# EAGLE board RastoMower (EAGLE 9.6.2), part 1 of 2
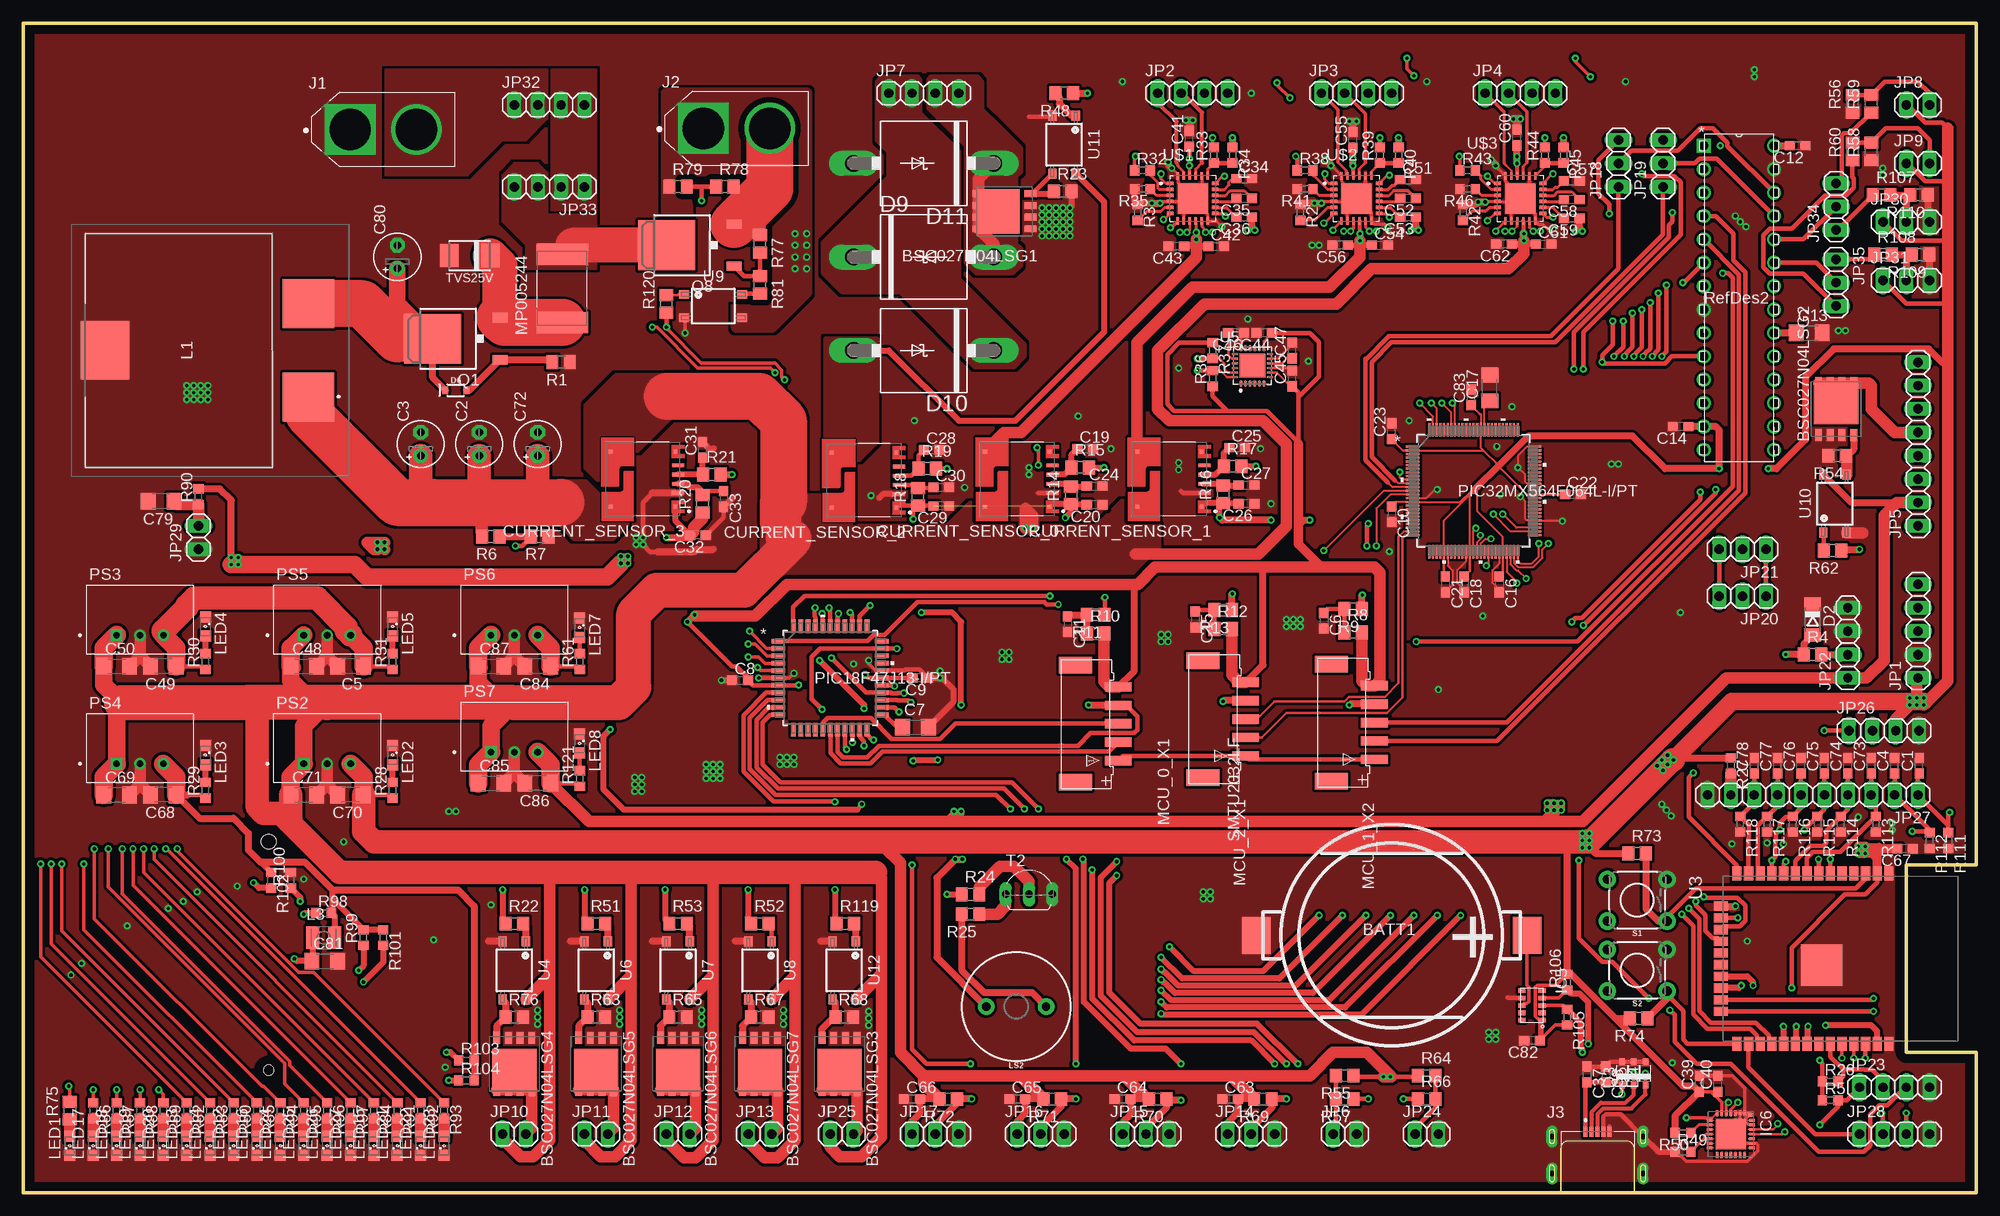
[diagram p10: board, top side]
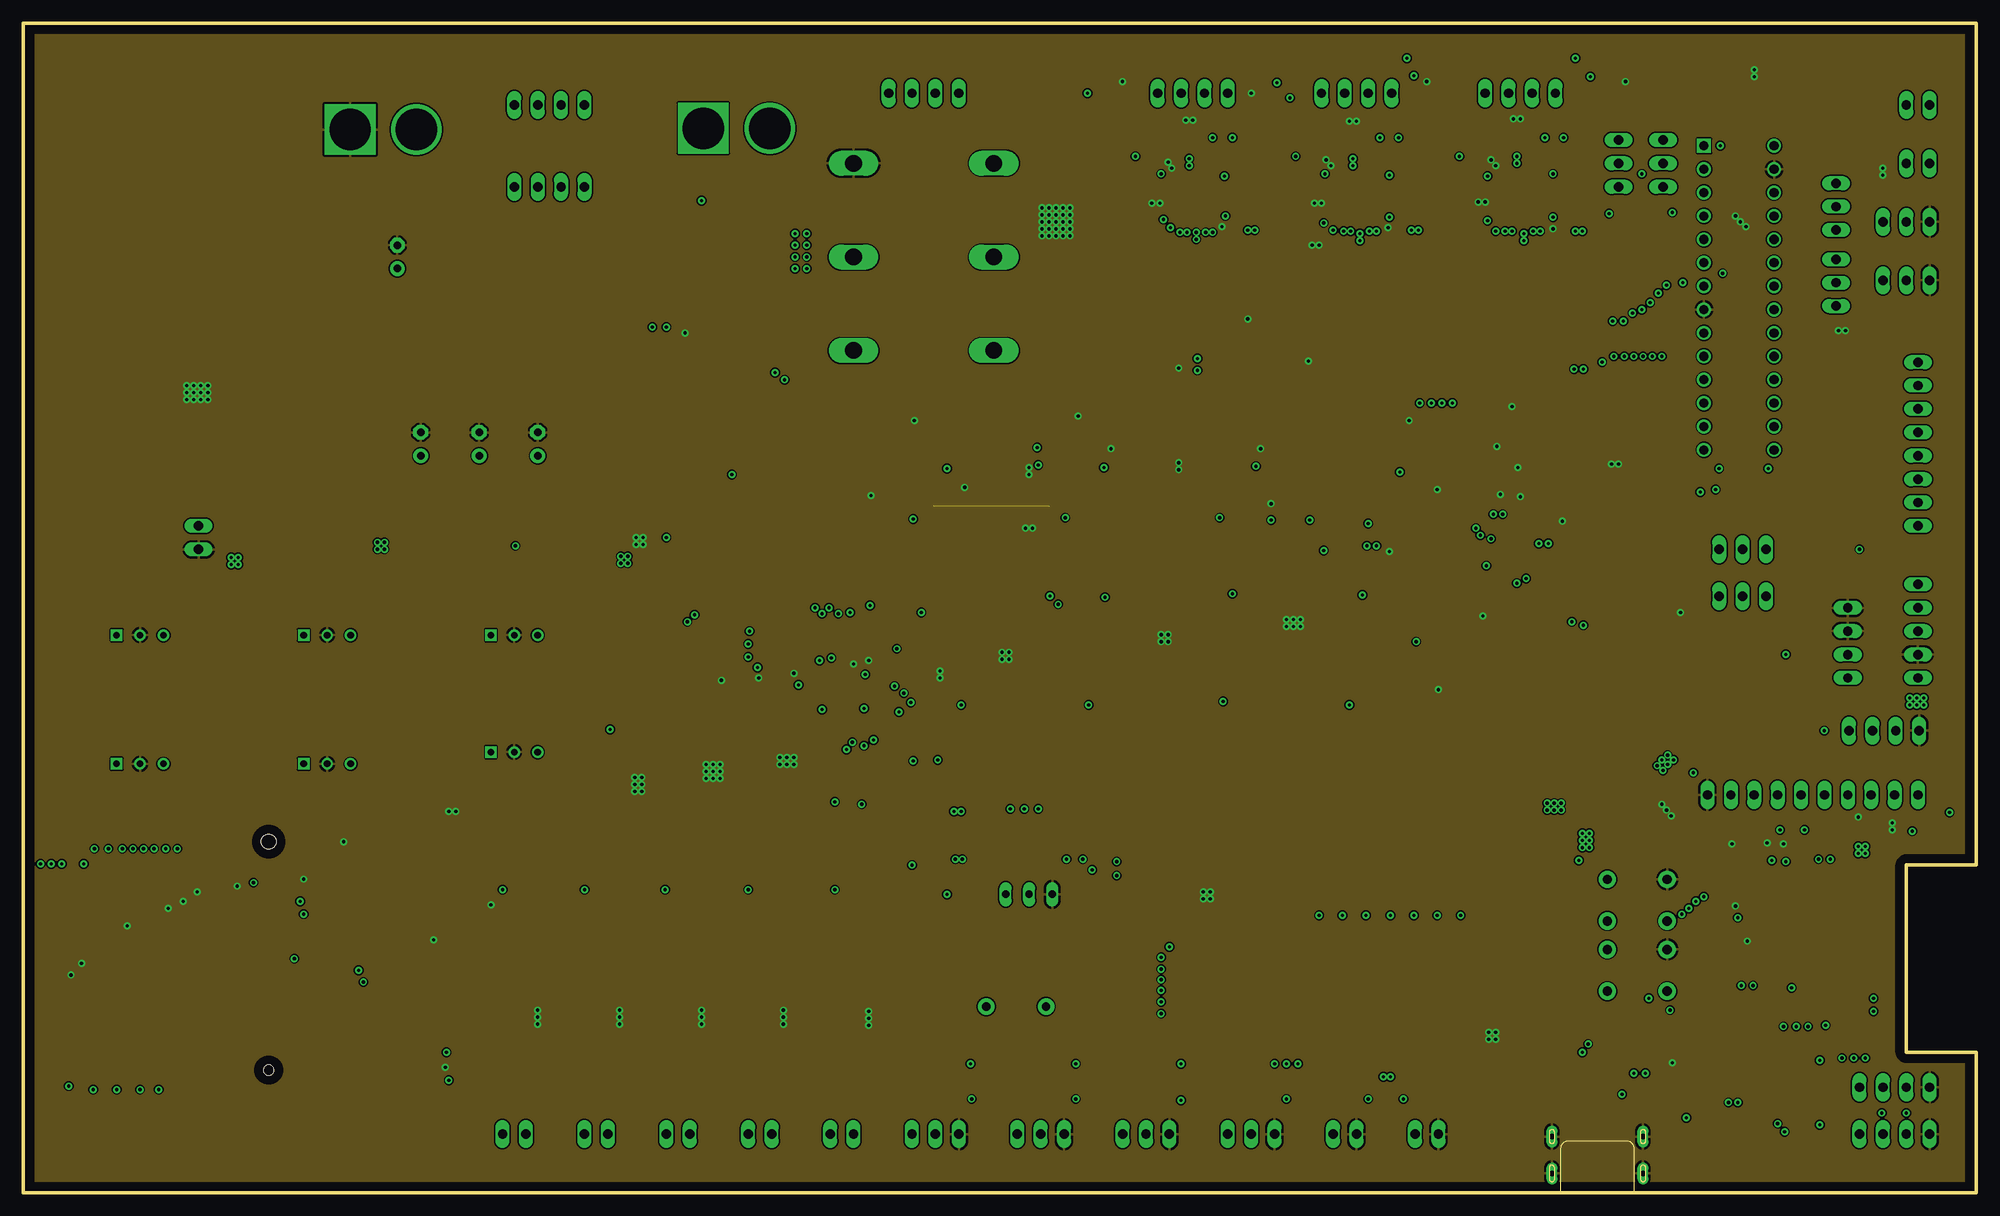
[diagram p11: board, inner layer Route2]
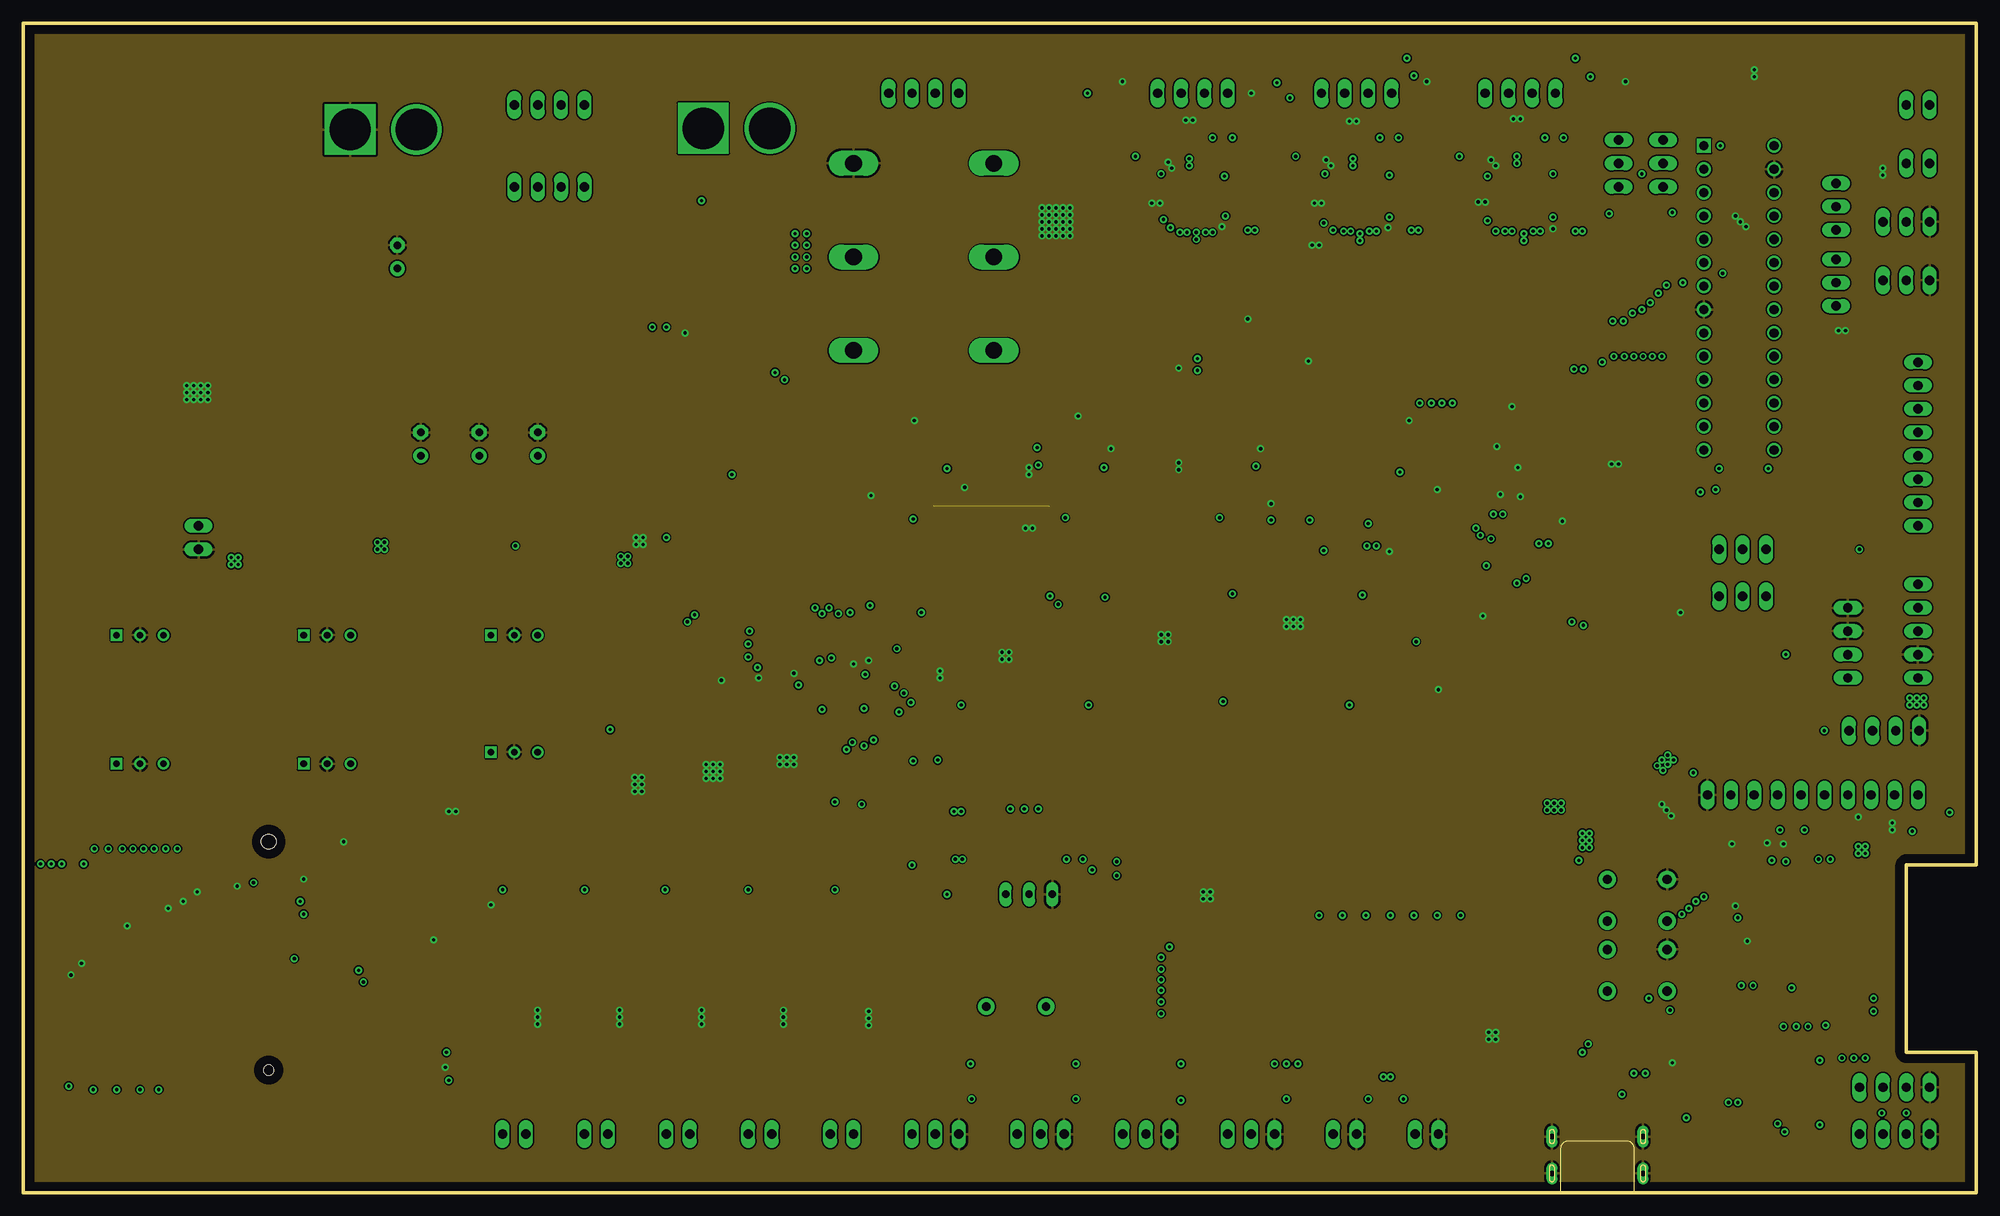
[diagram p12: board, inner layer Route15]
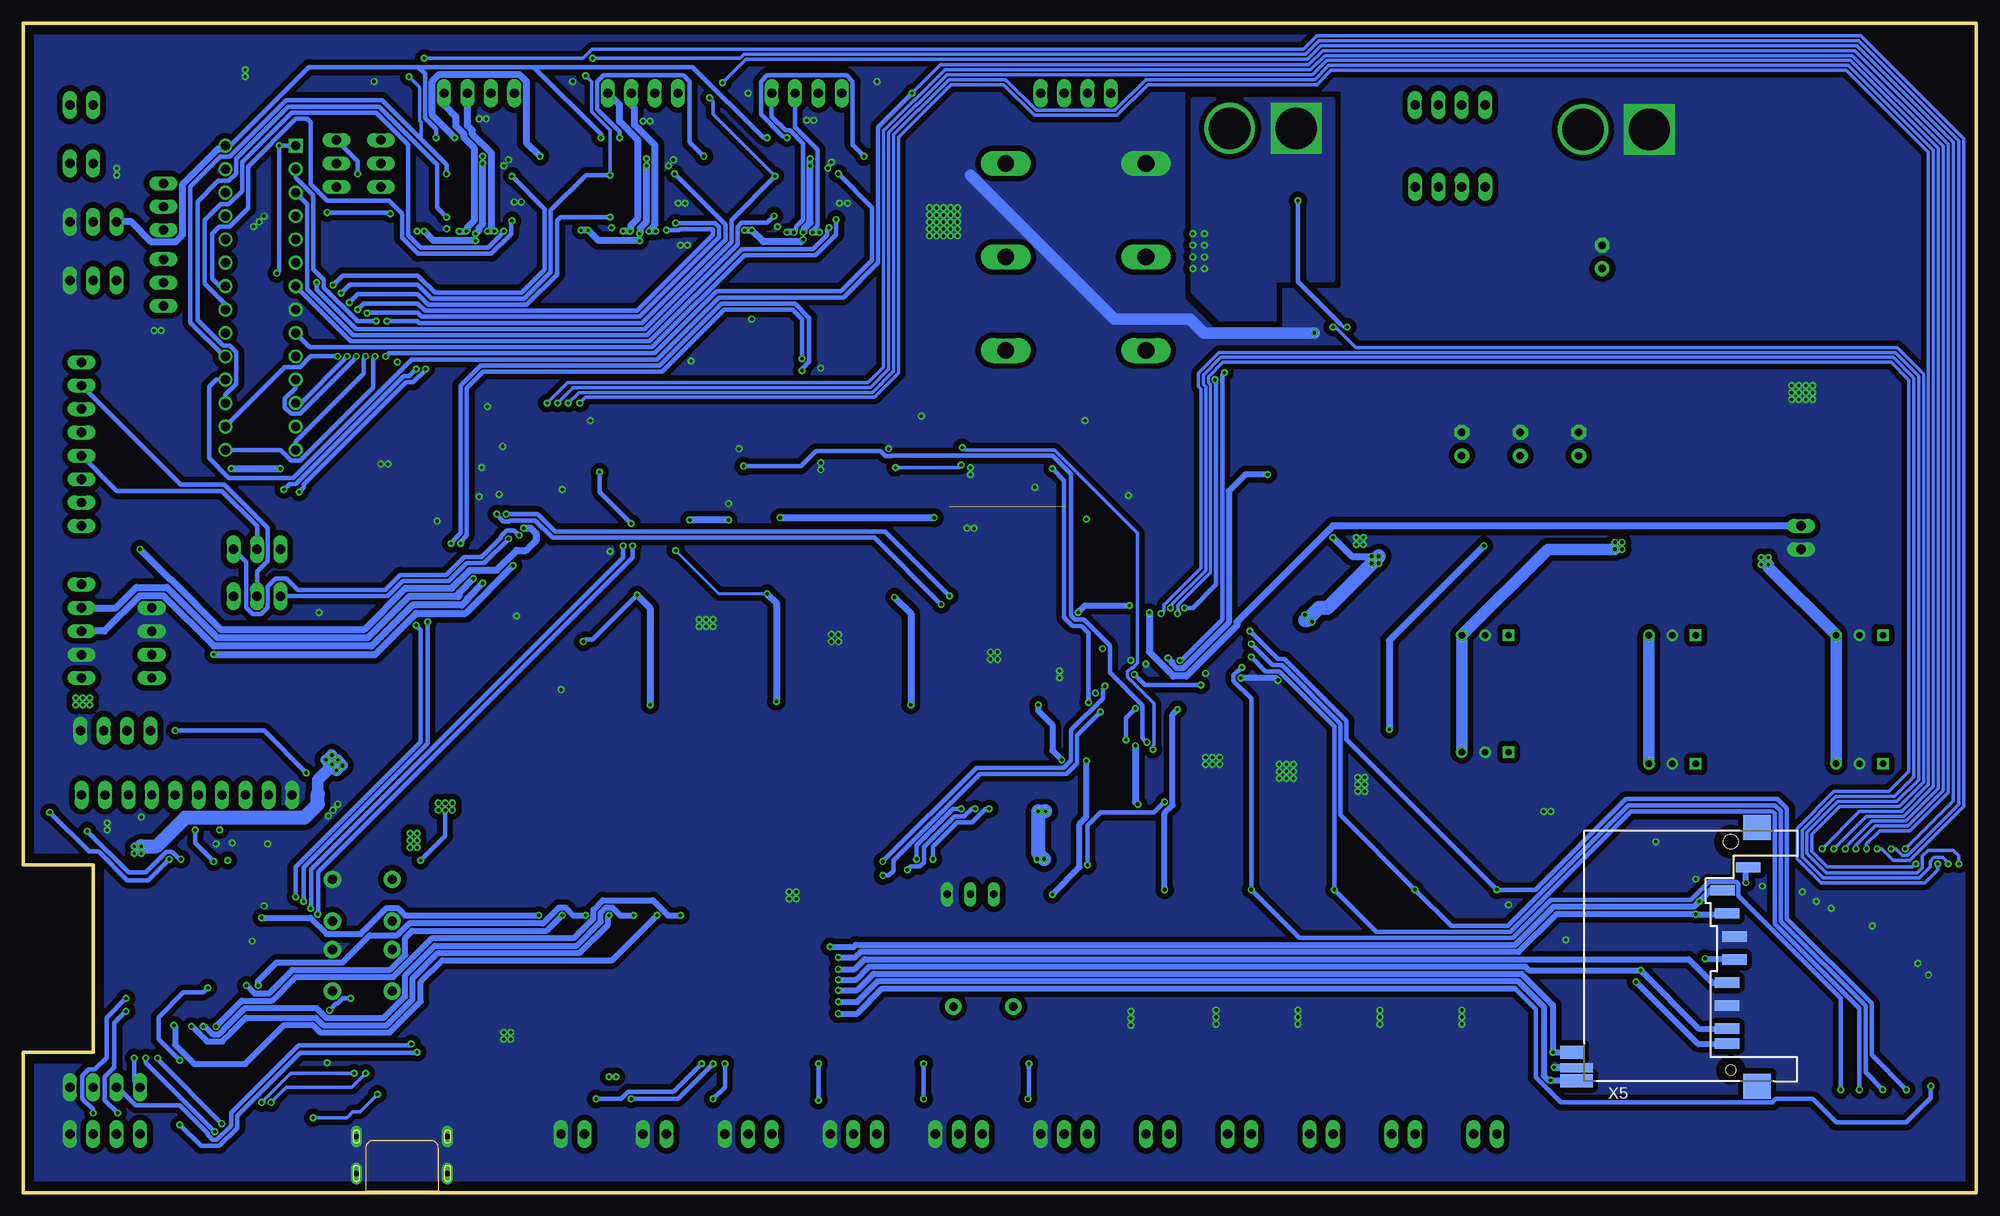
[diagram p13: board, bottom side, seen from below]

Size 212.09 x 127 mm. Coordinates in mm from the lower left corner, seen from the top.
Outline: 0,127 0,0 212.09,0 212.09,15.24 204.47,15.24 204.47,35.56 212.09,35.56 212.09,127 0,127
Copper layers (1+2*15+16): Top 0.07mm / dielectric 1.5mm / Route2 0.035mm / dielectric 0.15mm / Route15 0.035mm / dielectric 0.2mm / Bottom 0.07mm
Design rules "default *": minimum track width 6mil, minimum drill 0.35mm, track to track 6mil, track to pad 6mil, pad to pad 6mil, via to via 6mil, smd to smd 6mil, copper to edge 40mil, drill to drill 6mil, minimum pad ring 10mil, minimum via ring 8mil, stop-mask expansion 4mil, vias tented up to drill 0mil, thermal gap 10mil

## Footprints (pad centres in the part's own frame; a part is rotated, then mirrored left to right if it is on the bottom)
SMTU2032LF = smd 3.1 x 4: MINUS 14.7,0; PLUS -14.7,0
PG-TDSON-8 = smd 1.3 x 0.75: 1 -2.825,1.905; 2 -2.825,0.635; 3 -2.825,-0.635; 4 -2.825,-1.905; 5 2.825,-1.905; 6 2.825,-0.635; 7 2.825,0.635; 8 2.825,1.905 | smd 4.7 x 4.8: TH 0.725,0
C0603 = smd 1.1 x 1: 1 -0.85,0; 2 0.85,0
E2,5-5 = drill 0.813 pad 1.6: + -1.27,0 | drill 0.813 pad 1.6 octagon: - 1.27,0
C1206 = smd 1.6 x 1.8: 1 -1.4,0; 2 1.4,0
IC_TLI4971A050T5UE0001XUMA1 = smd 0.4 x 0.4: 1 -3.5,3; 6 -3.5,-3; 7 3.5,-3; 8 3.5,3 | smd 1.3 x 0.4: 2 -3.8,1.5; 3 -3.8,0.5; 4 -3.8,-0.5; 5 -3.8,-1.5
SOD80C = smd 1.4 x 1.8: A 1.7,0; C -1.7,0
SOD323_ST = smd 0.8 x 0.6: A 1.25,0; C -1.25,0
SOD-323 = smd 0.63 x 0.83: A 1.15,0; C -1.15,0
AG = drill 1.803 long: A 7.62,0; C -7.62,0
SPDIP28_300MC = drill 0.991 square: 1 -7.62,33.02 | drill 0.991: 2 -7.62,30.48; 3 -7.62,27.94; 4 -7.62,25.4; 5 -7.62,22.86; 6 -7.62,20.32; 7 -7.62,17.78; 8 -7.62,15.24; 9 -7.62,12.7; 10 -7.62,10.16; 11 -7.62,7.62; 12 -7.62,5.08; 13 -7.62,2.54; 14 -7.62,0; 15 0,0; 16 0,2.54; 17 0,5.08; 18 0,7.62; 19 0,10.16; 20 0,12.7; 21 0,15.24; 22 0,17.78; 23 0,20.32; 24 0,22.86; 25 0,25.4; 26 0,27.94; 27 0,30.48; 28 0,33.02
AB-RTCMC-32.768KHZ-B5ZE-S3-T = smd 0.5 x 0.8: 1 -1.6,-1.1; 2 -0.8,-1.1; 3 0,-1.1; 4 0.8,-1.1; 5 1.6,-1.1; 6 1.6,1.1; 7 0.8,1.1; 8 0,1.1; 9 -0.8,1.1; 10 -1.6,1.1
MLP28 = smd 0.6 x 0.3: 1 -2.3,1.5; 2 -2.3,1; 3 -2.3,0.5; 4 -2.3,0; 5 -2.3,-0.5; 6 -2.3,-1; 7 -2.3,-1.5; 15 2.3,-1.5; 16 2.3,-1; 17 2.3,-0.5; 18 2.3,0; 19 2.3,0.5; 20 2.3,1; 21 2.3,1.5 | smd 0.3 x 0.6: 8 -1.5,-2.3; 9 -1,-2.3; 10 -0.5,-2.3; 11 0,-2.3; 12 0.5,-2.3; 13 1,-2.3; 14 1.5,-2.3; 22 1.5,2.3; 23 1,2.3; 24 0.5,2.3; 25 0,2.3; 26 -0.5,2.3; 27 -1,2.3; 28 -1.5,2.3 | smd 3.3 x 3.3: EXP 0,0 | smd 0.435 x 0.435: M -2.103,2.103
AMASS_XT60-M = drill 4.5 square: 1 -3.6,0 | drill 4.5: 2 3.6,0
MOLEX_47642-0001 = smd 0.45 x 1.1: 1 -1.3,0; 2 -0.65,0; 3 0,0; 4 0.65,0; 5 1.3,0 | drill 0.6 pad 1.2 long: S1 -4.95,-0.52; S2 -4.95,-4.52; S3 4.95,-4.52; S4 4.95,-0.52
1X05 = drill 1.016 long: 1 -5.08,0; 2 -2.54,0; 3 0,0; 4 2.54,0; 5 5.08,0
1X04 = drill 1.016 long: 1 -3.81,0; 2 -1.27,0; 3 1.27,0; 4 3.81,0
1X08 = drill 1.016 long: 1 -8.89,0; 2 -6.35,0; 3 -3.81,0; 4 -1.27,0; 5 1.27,0; 6 3.81,0; 7 6.35,0; 8 8.89,0
1X02 = drill 1.016 long: 1 -1.27,0; 2 1.27,0
1X03 = drill 1.016 long: 1 -2.54,0; 2 0,0; 3 2.54,0
1X10 = drill 1.016 long: 1 -11.43,0; 2 -8.89,0; 3 -6.35,0; 4 -3.81,0; 5 -1.27,0; 6 1.27,0; 7 3.81,0; 8 6.35,0; 9 8.89,0; 10 11.43,0
74436413300 = smd 5.33 x 5.59: 1 -5.075,-10.66; 2 5.075,-10.66 | smd 6.35 x 5.28: 3 0,11.415
L2825P = smd 1.4 x 2.4: 1 -1.2,0; 2 1.2,0
SML0805 = smd 1.2 x 1.2: A 1.05,0; C -1.05,0
BUZZER-12MM = drill 0.9 pad 1.778: + 3.25,0; - -3.25,0
BM05B-PASS = smd 1.8 x 3.6: A 0.15,-3.35; B -12.55,-3.35 | smd 1 x 2.9: P$1 -2.2,1.3; P$2 -4.2,1.3; P$3 -6.2,1.3; P$4 -8.2,1.3; P$5 -10.2,1.3
FUSE_0ZCF0075AF2C = smd 2.3 x 5.6: 1 -3.7,0; 2 3.7,0
CONV_TSR_1-2433E = drill 0.73 pad 1.13 square: 1 -2.54,-1.7 | drill 0.73 pad 1.13: 2 0,-1.7; 3 2.54,-1.7
TO252 = smd 1 x 1.6: 1 -2.28,-4.8; 2 2.28,-4.8 | smd 5.4 x 6.2: 3 0,2.5
R0805 = smd 1.3 x 1.5: 1 -0.95,0; 2 0.95,0
R0603 = smd 1 x 1.1: 1 -0.85,0; 2 0.85,0
TACTILE_SWITCH_PTH_6.0MM = drill 1.016 pad 1.88: 1 -3.251,2.261; 2 3.251,2.261; 3 -3.251,-2.261; 4 3.251,-2.261
TO92-CBE = drill 0.813 long: B 0,0; C -2.54,0; E 2.54,0
SUPRESSOR_SMAJ = smd 2 x 2.5: A 2.223,0; C -2.223,0
TQFP44_10X10MC_MCH = smd 1.473 x 0.508: 1 -5.613,4; 2 -5.613,3.2; 3 -5.613,2.4; 4 -5.613,1.6; 5 -5.613,0.8; 6 -5.613,0; 7 -5.613,-0.8; 8 -5.613,-1.6; 9 -5.613,-2.4; 10 -5.613,-3.2; 11 -5.613,-4; 23 5.613,-4; 24 5.613,-3.2; 25 5.613,-2.4; 26 5.613,-1.6; 27 5.613,-0.8; 28 5.613,0; 29 5.613,0.8; 30 5.613,1.6; 31 5.613,2.4; 32 5.613,3.2; 33 5.613,4 | smd 0.508 x 1.473: 12 -4,-5.613; 13 -3.2,-5.613; 14 -2.4,-5.613; 15 -1.6,-5.613; 16 -0.8,-5.613; 17 0,-5.613; 18 0.8,-5.613; 19 1.6,-5.613; 20 2.4,-5.613; 21 3.2,-5.613; 22 4,-5.613; 34 4,5.613; 35 3.2,5.613; 36 2.4,5.613; 37 1.6,5.613; 38 0.8,5.613; 39 0,5.613; 40 -0.8,5.613; 41 -1.6,5.613; 42 -2.4,5.613; 43 -3.2,5.613; 44 -4,5.613
TQFP100_12X12MC_MCH = smd 1.473 x 0.229: 1 -6.617,4.8; 2 -6.617,4.4; 3 -6.617,4; 4 -6.617,3.6; 5 -6.617,3.2; 6 -6.617,2.8; 7 -6.617,2.4; 8 -6.617,2; 9 -6.617,1.6; 10 -6.617,1.2; 11 -6.617,0.8; 12 -6.617,0.4; 13 -6.617,0; 14 -6.617,-0.4; 15 -6.617,-0.8; 16 -6.617,-1.2; 17 -6.617,-1.6; 18 -6.617,-2; 19 -6.617,-2.4; 20 -6.617,-2.8; 21 -6.617,-3.2; 22 -6.617,-3.6; 23 -6.617,-4; 24 -6.617,-4.4; 25 -6.617,-4.8; 51 6.617,-4.8; 52 6.617,-4.4; 53 6.617,-4; 54 6.617,-3.6; 55 6.617,-3.2; 56 6.617,-2.8; 57 6.617,-2.4; 58 6.617,-2; 59 6.617,-1.6; 60 6.617,-1.2; 61 6.617,-0.8; 62 6.617,-0.4; 63 6.617,0; 64 6.617,0.4; 65 6.617,0.8; 66 6.617,1.2; 67 6.617,1.6; 68 6.617,2; 69 6.617,2.4; 70 6.617,2.8; 71 6.617,3.2; 72 6.617,3.6; 73 6.617,4; 74 6.617,4.4; 75 6.617,4.8 | smd 0.229 x 1.473: 26 -4.8,-6.617; 27 -4.4,-6.617; 28 -4,-6.617; 29 -3.6,-6.617; 30 -3.2,-6.617; 31 -2.8,-6.617; 32 -2.4,-6.617; 33 -2,-6.617; 34 -1.6,-6.617; 35 -1.2,-6.617; 36 -0.8,-6.617; 37 -0.4,-6.617; 38 0,-6.617; 39 0.4,-6.617; 40 0.8,-6.617; 41 1.2,-6.617; 42 1.6,-6.617; 43 2,-6.617; 44 2.4,-6.617; 45 2.8,-6.617; 46 3.2,-6.617; 47 3.6,-6.617; 48 4,-6.617; 49 4.4,-6.617; 50 4.8,-6.617; 76 4.8,6.617; 77 4.4,6.617; 78 4,6.617; 79 3.6,6.617; 80 3.2,6.617; 81 2.8,6.617; 82 2.4,6.617; 83 2,6.617; 84 1.6,6.617; 85 1.2,6.617; 86 0.8,6.617; 87 0.4,6.617; 88 0,6.617; 89 -0.4,6.617; 90 -0.8,6.617; 91 -1.2,6.617; 92 -1.6,6.617; 93 -2,6.617; 94 -2.4,6.617; 95 -2.8,6.617; 96 -3.2,6.617; 97 -3.6,6.617; 98 -4,6.617; 99 -4.4,6.617; 100 -4.8,6.617
ESP-32S = smd 1.5 x 1: 1 -9.25,7; 2 -9.25,5.73; 3 -9.25,4.46; 4 -9.25,3.19; 5 -9.25,1.92; 6 -9.25,0.65; 7 -9.25,-0.62; 8 -9.25,-1.89; 9 -9.25,-3.16; 10 -9.25,-4.43; 11 -9.25,-5.7; 12 -9.25,-6.97; 13 -9.25,-8.24; 14 -9.25,-9.51; 25 9.25,-9.51; 26 9.25,-8.24; 27 9.25,-6.97; 28 9.25,-5.7; 29 9.25,-4.43; 30 9.25,-3.16; 31 9.25,-1.89; 32 9.25,-0.62; 33 9.25,0.65; 34 9.25,1.92; 35 9.25,3.19; 36 9.25,4.46; 37 9.25,5.73; 38 9.25,7 | smd 1 x 1.5: 15 -5.7,-11.25; 16 -4.43,-11.25; 17 -3.16,-11.25; 18 -1.89,-11.25; 19 -0.62,-11.25; 20 0.65,-11.25; 21 1.92,-11.25; 22 3.19,-11.25; 23 4.46,-11.25; 24 5.73,-11.25 | smd 4.5 x 4.5: GND 0.68,-0.33
WL-OCPT_SOP4 = smd 1.1 x 0.9: 1 -3.15,1.27; 2 -3.15,-1.27; 3 3.15,-1.27; 4 3.15,1.27
24-VFQFN = smd 0.26 x 0.69: 1 -1.25,-1.92; 2 -0.75,-1.92; 3 -0.25,-1.92; 4 0.25,-1.92; 5 0.75,-1.92; 6 1.25,-1.92; 13 1.25,1.92; 14 0.75,1.92; 15 0.25,1.92; 16 -0.25,1.92; 17 -0.75,1.92; 18 -1.25,1.92 | smd 0.69 x 0.26: 7 1.92,-1.25; 8 1.92,-0.75; 9 1.92,-0.25; 10 1.92,0.25; 11 1.92,0.75; 12 1.92,1.25; 19 -1.92,1.25; 20 -1.92,0.75; 21 -1.92,0.25; 22 -1.92,-0.25; 23 -1.92,-0.75; 24 -1.92,-1.25 | smd 2.7 x 2.6: 25 0,0
QFN65P500X500X100-25N = smd 0.81 x 0.32: 1 -2.45,1.625; 2 -2.45,0.975; 3 -2.45,0.325; 4 -2.45,-0.325; 5 -2.45,-0.975; 6 -2.45,-1.625; 13 2.45,-1.625; 14 2.45,-0.975; 15 2.45,-0.325; 16 2.45,0.325; 17 2.45,0.975; 18 2.45,1.625 | smd 0.32 x 0.81: 7 -1.625,-2.45; 8 -0.975,-2.45; 9 -0.325,-2.45; 10 0.325,-2.45; 11 0.975,-2.45; 12 1.625,-2.45; 19 1.625,2.45; 20 0.975,2.45; 21 0.325,2.45; 22 -0.325,2.45; 23 -0.975,2.45; 24 -1.625,2.45 | smd 3.25 x 3.25: 25 0,0
FPS009-3000 = smd 2.65 x 1.1: 1 -0.915,-5.3; 2 -0.415,-7.8; 3 0.385,-10.3; 4 0.385,-12.8; 5 -0.415,-15.3; 6 -0.415,-17.8; 7 -0.415,-20.3; 8 -0.415,-21.925; 9 1.885,-2.8 | smd 3.5 x 1: COM_TERM -16.75,-24.55 | smd 2.5 x 1.4: DETECT -17.25,-22.85 | smd 3 x 2.7: M1 2.85,1.55; M2 2.85,-26.55 | smd 3.5 x 1.4: WRITE_PROT -16.75,-25.95 | hole 1.6: 0,0 | hole 1.1: 0,-24.8

## Placement (x,y rotation side)
BATT1  SMTU2032LF  [SMTU2032LF]  148.59,27.94 180 top
BSC027N04LSG1  BSC340N08NS3G  [PG-TDSON-8]  106.55,106.55 180 top
BSC027N04LSG2  BSC340N08NS3G  [PG-TDSON-8]  196.85,85.09 90 top
BSC027N04LSG3  BSC340N08NS3G  [PG-TDSON-8]  88.65,13.97 270 top
BSC027N04LSG4  BSC340N08NS3G  [PG-TDSON-8]  53.34,13.97 270 top
BSC027N04LSG5  BSC340N08NS3G  [PG-TDSON-8]  62.23,13.97 270 top
BSC027N04LSG6  BSC340N08NS3G  [PG-TDSON-8]  71.12,13.97 270 top
BSC027N04LSG7  BSC340N08NS3G  [PG-TDSON-8]  80.01,13.97 270 top
C1  10n  [C0603]  205.87,46.35 90 top
C2  220u  [E2,5-5]  49.53,81.28 90 top
C3  220u  [E2,5-5]  43.18,81.28 90 top
C4  10n  [C0603]  203.2,46.35 90 top
C5  4.7u  [C1206]  35.56,57.15 180 top
C6  100nF  [C0603]  141.22,62.1 270 top
C7  10u 6.3V  [C1206]  96.9,50.55 0 top
C8  100nF  [C0603]  77.85,55.63 0 top
C9  100nF  [C0603]  97.41,55.88 180 top
C10  100n  [C0603]  148.59,73.66 270 top
C11  100nF  [C0603]  113.41,61.72 270 top
C12  100nF  [C0603]  192.66,113.66 180 top
C13  10u 6.3V  [C1206]  193.93,93.34 0 top
C14  100nF  [C0603]  179.96,83.19 180 top
C15  100nF  [C0603]  127.25,62.23 270 top
C16  100n  [C0603]  160.27,66.04 270 top
C17  10u 6.3V  [C1206]  159.26,87.38 90 top
C18  100n  [C0603]  156.46,66.04 270 top
C19  6.8nF 25V  [C0603]  115.32,80.77 0 top
C20  6.8nF 25V  [C0603]  116.33,74.68 180 top
C21  100n  [C0603]  154.43,66.04 270 top
C22  100n  [C0603]  168.28,75.82 0 top
C23  100n  [C0603]  148.59,82.68 90 top
C24  6.8nF 25V  [C0603]  116.33,76.71 0 top
C25  6.8nF 25V  [C0603]  131.83,80.9 0 top
C26  6.8nF 25V  [C0603]  132.84,74.8 180 top
C27  6.8nF 25V  [C0603]  132.84,76.83 0 top
C28  6.8nF 25V  [C0603]  98.68,80.64 0 top
C29  6.8nF 25V  [C0603]  99.69,74.55 180 top
C30  6.8nF 25V  [C0603]  99.69,76.58 0 top
C31  6.8nF 25V  [C0603]  73.79,80.64 90 top
C32  6.8nF 25V  [C0603]  73.28,71.37 180 top
C33  6.8nF 25V  [C0603]  76.07,75.31 270 top
C34  220nF  [C0603]  132.59,110.11 0 top
C35  100nF  [C0603]  132.59,107.95 180 top
C36  100nF  [C0603]  132.59,105.92 180 top
C37  1u  [C0603]  169.8,12.83 270 top
C38  100n  [C0603]  171.83,12.83 270 top
C39  100n  [C0603]  181.99,11.81 90 top
C40  4.7u  [C0603]  184.02,11.81 90 top
C41  100n  [C0603]  126.62,114.43 90 top
C42  100nF  [C0603]  129.54,102.74 0 top
C43  4.7uF  [C0603]  125.22,102.74 180 top
C44  10nF  [C0603]  134.75,93.34 180 top
C45  100nF  [C0603]  137.79,88.39 90 top
C46  2.2nF 50V  [C0603]  131.7,93.34 180 top
C47  100nF  [C0603]  137.79,91.44 90 top
C48  4.7u  [C1206]  30.48,57.15 0 top
C49  4.7u  [C1206]  15.24,57.15 180 top
C50  4.7u  [C1206]  10.16,57.15 0 top
C51  220nF  [C0603]  150.37,109.98 0 top
C52  100nF  [C0603]  150.37,107.95 180 top
C53  100nF  [C0603]  150.37,105.92 180 top
C54  100n  [C0603]  147.32,102.87 0 top
C55  100nF  [C0603]  144.4,114.3 90 top
C56  4.7uF  [C0603]  143,102.87 180 top
C57  220nF  [C0603]  168.15,109.85 0 top
C58  100nF  [C0603]  168.15,107.82 180 top
C59  100nF  [C0603]  168.15,105.79 180 top
C60  100n  [C0603]  162.18,114.55 90 top
C61  100nF  [C0603]  165.1,103 0 top
C62  4.7uF  [C0603]  160.78,103 180 top
C63  1u  [C0603]  131.06,10.16 0 top
C64  1u  [C0603]  119.38,10.16 0 top
C65  1u  [C0603]  107.95,10.16 0 top
C66  1u  [C0603]  96.52,10.16 0 top
C67  100n  [C0603]  204.34,37.34 180 top
C68  4.7u  [C1206]  15.24,43.18 180 top
C69  4.7u  [C1206]  10.16,43.18 0 top
C70  4.7u  [C1206]  35.56,43.18 180 top
C71  4.7u  [C1206]  30.48,43.18 0 top
C72  220u  [E2,5-5]  55.88,81.28 90 top
C73  10n  [C0603]  200.66,46.35 90 top
C74  10n  [C0603]  198.12,46.35 90 top
C75  10n  [C0603]  195.58,46.35 90 top
C76  10n  [C0603]  193.04,46.35 90 top
C77  10n  [C0603]  190.5,46.35 90 top
C78  10n  [C0603]  187.96,46.35 90 top
C79  100n  [C1206]  14.99,75.06 180 top
C80  220u  [E2,5-5]  40.64,101.6 90 top
C81  47u/6V3  [C1206]  32.77,25.15 0 top
C82  100n  [C0603]  163.83,16.51 180 top
C83  100n  [C0603]  157.23,86.36 90 top
C84  4.7u  [C1206]  55.88,57.15 180 top
C85  4.7u  [C1206]  50.8,44.45 0 top
C86  4.7u  [C1206]  55.88,44.45 180 top
C87  4.7u  [C1206]  50.8,57.15 0 top
CURRENT_SENSOR_0  TLI4971A050T5UE0001XUMA1  [IC_TLI4971A050T5UE0001XUMA1]  107.95,77.47 180 top
CURRENT_SENSOR_1  TLI4971A050T5UE0001XUMA1  [IC_TLI4971A050T5UE0001XUMA1]  124.46,77.47 180 top
CURRENT_SENSOR_2  TLI4971A050T5UE0001XUMA1  [IC_TLI4971A050T5UE0001XUMA1]  91.31,77.34 180 top
CURRENT_SENSOR_3  TLI4971A050T5UE0001XUMA1  [IC_TLI4971A050T5UE0001XUMA1]  67.31,77.47 180 top
D2  3V3  [SOD80C]  194.31,62.23 270 top
D3  BAT60J  [SOD323_ST]  173.61,12.95 90 top
D4  BAT60J  [SOD323_ST]  176.15,12.95 90 top
D5  BAT60J  [SOD323_ST]  174.88,12.95 90 top
D6  6.8V  [SOD-323]  46.99,87.12 0 top
D9  [AG]  97.79,101.6 0 top
D10  [AG]  97.79,91.44 180 top
D11  [AG]  97.79,111.76 180 top
IC1  PIC24FJ32GA002-X  [SPDIP28_300MC]  190.12,80.64 0 top
IC5  [AB-RTCMC-32.768KHZ-B5ZE-S3-T]  163.83,20.32 90 top
IC6  CP2102  [MLP28]  185.42,6.35 270 top
J1  XT60-M  [AMASS_XT60-M]  39.12,115.44 0 top
J2  XT60-M  [AMASS_XT60-M]  77.47,115.57 0 top
J3  MICROUSB  [MOLEX_47642-0001]  170.94,6.6 0 top
JP1  GPS MODULE  [1X05]  205.74,60.96 90 top
JP2  STEPPER_0  [1X04]  127,119.38 0 top
JP3  STEPPER_1  [1X04]  144.78,119.38 0 top
JP4  STEPPER_2  [1X04]  162.56,119.38 0 top
JP5  LIDAR  [1X08]  205.74,81.28 90 top
JP6  RAIN SENSOR  [1X02]  143.51,6.35 0 top
JP7  BLADE MOTOR  [1X04]  97.79,119.38 0 top
JP8  LIMIT SWITCH UP  [1X02]  205.74,118.11 0 top
JP9  LIMIT SWITCH DOWN  [1X02]  205.74,111.76 0 top
JP10  FAN_0  [1X02]  53.34,6.35 0 top
JP11  FAN_1  [1X02]  62.23,6.35 0 top
JP12  FAN_2  [1X02]  71.12,6.35 0 top
JP13  FAN_3  [1X02]  80.01,6.35 0 top
JP14  TEMP SENSOR 0  [1X03]  133.35,6.35 0 top
JP15  TEMP SENSOR 1  [1X03]  121.92,6.35 0 top
JP16  TEMP SENSOR 2  [1X03]  110.49,6.35 0 top
JP17  TEMP SENSOR 3  [1X03]  99.06,6.35 0 top
JP18  MOTOR DRIVER UART RX SWITCH  [1X03]  173.23,111.76 90 top
JP19  MOTOR DRIVER UART TX SWITCH  [1X03]  178.05,111.76 90 top
JP20  LIDAR UART TX SWITCH  [1X03]  186.69,64.77 180 top
JP21  LIDAR UART RX SWITCH  [1X03]  186.69,69.85 180 top
JP22  PER.WIRE SENSE  [1X04]  198.12,59.69 90 top
JP23  DISPLAY  [1X04]  203.2,11.43 0 top
JP24  PHOTORESISTOR LDR5549  [1X02]  152.4,6.35 0 top
JP25  EMERGENCY LIGHT  [1X02]  88.9,6.35 0 top
JP26  ESP32_CAMERA  [1X04]  202.06,50.16 0 top
JP27  BUTTONS  [1X10]  194.31,43.18 180 top
JP28  RGB_LED  [1X04]  203.2,6.35 0 top
JP29  TILT SENSOR  [1X02]  19.05,71.12 90 top
JP30  LIMIT_SWITCH_UPPER_MAGNETIC  [1X03]  204.47,105.41 0 top
JP31  LIMIT_SWITCH_BOTTOM_MAGNETIC  [1X03]  204.47,99.06 0 top
JP32  MAIN SWITCH  [1X04]  57.15,118.11 0 top
JP33  CUTOFF SWITCH  [1X04]  57.15,109.22 180 top
JP34  UPPER LIMIT SWITCH SELECTOR  [1X03]  196.85,107.06 90 top
JP35  BOTTOM LIMIT SWITCH SELECTOR  [1X03]  196.85,98.81 270 top
L1  7443641500  [74436413300]  20.32,91.44 90 top
L3  2112805  [L2825P]  32.64,27.69 0 top
LED1  [SML0805]  5.08,5.08 90 top
LED2  [SML0805]  40.13,47.5 270 top
LED3  [SML0805]  19.81,47.5 270 top
LED4  [SML0805]  19.81,61.47 270 top
LED5  [SML0805]  40.13,61.47 270 top
LED7  [SML0805]  60.45,61.34 270 top
LED8  [SML0805]  60.45,48.77 270 top
LED12  [SML0805]  22.86,5.08 90 top
LED13  [SML0805]  17.78,5.08 90 top
LED14  [SML0805]  20.32,5.08 90 top
LED15  [SML0805]  38.1,5.08 90 top
LED16  [SML0805]  25.4,5.08 90 top
LED17  [SML0805]  7.62,5.08 90 top
LED18  [SML0805]  10.16,5.08 90 top
LED19  [SML0805]  12.7,5.08 90 top
LED20  [SML0805]  15.24,5.08 90 top
LED21  [SML0805]  40.64,5.08 90 top
LED22  [SML0805]  43.18,5.08 90 top
LED23  [SML0805]  45.72,5.08 90 top
LED24  [SML0805]  27.94,5.08 90 top
LED25  [SML0805]  30.48,5.08 90 top
LED26  [SML0805]  33.02,5.08 90 top
LED27  [SML0805]  35.56,5.08 90 top
LS2  BUZZER-PTH  [BUZZER-12MM]  107.82,20.19 180 top
MCU_0_X1  BM05B-PASS_STANDARD  [BM05B-PASS]  117.6,44.7 270 top
MCU_1_X2  BM05B-PASS_STANDARD  [BM05B-PASS]  145.41,44.83 270 top
MCU_2_X1  BM05B-PASS_STANDARD  [BM05B-PASS]  131.44,45.21 270 top
MP005244  0ZCF0075AF2C  [FUSE_0ZCF0075AF2C]  58.55,98.17 90 top
PS2  TSR_1-2433E  [CONV_TSR_1-2433E]  33.02,48.26 0 top
PS3  TSR_1-2433E  [CONV_TSR_1-2433E]  12.7,62.23 0 top
PS4  TSR_1-2433E  [CONV_TSR_1-2433E]  12.7,48.26 0 top
PS5  TSR_1-2433E  [CONV_TSR_1-2433E]  33.02,62.23 0 top
PS6  TSR_1-2433E  [CONV_TSR_1-2433E]  53.34,62.23 0 top
PS7  TSR_1-2433E  [CONV_TSR_1-2433E]  53.34,49.53 0 top
Q1  FDD4141TO252  [TO252]  46.99,92.71 90 top
Q8  FDD4141TO252  [TO252]  72.39,102.87 90 top
R1  100R  [R0805]  58.42,90.17 180 top
R2  220k  [R0603]  138.68,106.43 270 top
R3  220k  [R0603]  121.03,106.43 270 top
R4  1k  [R0805]  194.31,58.42 0 top
R5  4.7k  [R0603]  196.22,10.03 0 top
R6  1M  [R0805]  50.8,71.25 180 top
R7  110k  [R0805]  56.13,71.25 180 top
R8  10k  [R0805]  144.4,60.83 0 top
R9  1k  [R0805]  144.4,63.37 180 top
R10  10k  [R0805]  116.46,60.71 0 top
R11  100R  [R0805]  116.46,62.74 180 top
R12  10k  [R0805]  130.3,61.21 0 top
R13  1k  [R0805]  130.3,63.25 180 top
R14  220R  [R0805]  113.79,75.69 90 top
R15  220R  [R0805]  114.81,78.74 0 top
R16  220R  [R0805]  130.3,75.82 90 top
R17  220R  [R0805]  131.32,78.87 0 top
R18  220R  [R0805]  97.16,75.56 90 top
R19  220R  [R0805]  98.17,78.61 0 top
R20  220R  [R0805]  73.79,74.8 90 top
R21  220R  [R0805]  74.8,77.98 0 top
R22  200R  [R0805]  53.34,29.21 0 top
R23  1k  [R0805]  112.9,108.71 0 top
R24  100R  [R0805]  102.87,32.38 0 top
R25  100R  [R0805]  102.87,30.23 180 top
R26  4.7k  [R0603]  196.22,12.06 0 top
R27  1k  [R0603]  185.42,46.35 270 top
R28  100R  [R0603]  40.13,43.69 90 top
R29  100R  [R0603]  19.81,43.69 90 top
R30  100R  [R0603]  19.81,57.66 90 top
R31  100R  [R0603]  40.13,57.66 90 top
R32  1.5k  [R0603]  121.54,111 0 top
R33  10k  [R0603]  129.29,112.65 90 top
R34  0R  [R0603]  131.32,112.65 270 top
R35  39k  [R0603]  121.54,108.97 180 top
R36  4.7k  [R0603]  129.16,88.39 90 top
R37  4.7k  [R0603]  129.16,91.44 270 top
R38  1.5k  [R0603]  139.19,111 0 top
R39  10k  [R0603]  147.32,112.65 90 top
R40  0R  [R0603]  149.35,112.65 270 top
R41  39k  [R0603]  139.19,108.97 180 top
R42  220k  [R0603]  156.34,106.43 270 top
R43  1.5k  [R0603]  156.84,111 0 top
R44  10k  [R0603]  165.23,112.65 90 top
R45  0R  [R0603]  167.26,112.65 270 top
R46  39k  [R0603]  156.84,108.97 180 top
R48  100R  [R0805]  113.03,119.38 180 top
R49  10k  [R0603]  180.21,4.44 0 top
R50  4.7k  [R0603]  180.21,6.48 180 top
R51  200R  [R0805]  62.23,29.21 0 top
R52  200R  [R0805]  80.01,29.21 0 top
R53  200R  [R0805]  71.12,29.21 0 top
R54  1k  [R0805]  196.98,80.01 180 top
R55  500k  [R0805]  143.51,12.7 180 top
R56  10k  [R0805]  198.63,118.24 90 top
R57  10R  [R0805]  143.51,10.16 180 top
R58  10k  [R0805]  200.66,113.03 90 top
R59  10k  [R0805]  200.66,118.24 90 top
R60  10k  [R0805]  198.63,113.03 90 top
R61  100R  [R0603]  60.45,57.66 90 top
R62  200R  [R0805]  196.47,69.72 180 top
R63  1k  [R0805]  62.23,19.05 0 top
R64  500k  [R0805]  152.4,12.7 0 top
R65  1k  [R0805]  71.12,19.05 0 top
R66  10R  [R0805]  152.4,10.16 0 top
R67  1k  [R0805]  80.01,19.05 0 top
R68  1k  [R0805]  89.15,19.05 0 top
R69  5k  [R0805]  134.62,10.16 180 top
R70  5k  [R0805]  123.19,10.16 180 top
R71  5k  [R0805]  111.76,10.16 180 top
R72  5k  [R0805]  100.46,10.16 180 top
R73  12k  [R0805]  175.26,36.83 0 top
R74  12k  [R0805]  175.39,18.92 180 top
R75  220R  [R0805]  5.08,8.89 90 top
R76  1k  [R0805]  53.34,19.05 0 top
R77  5K  [R0805]  80.01,103 270 top
R78  1M  [R0805]  76.2,109.22 0 top
R79  110k  [R0805]  71.12,109.22 0 top
R80  130R  [R0603]  22.86,8.89 270 top
R81  220R  [R0805]  80.01,98.55 270 top
R82  130R  [R0603]  17.78,8.89 270 top
R83  130R  [R0603]  20.32,8.89 270 top
R84  130R  [R0603]  38.1,8.89 270 top
R85  130R  [R0603]  25.4,8.89 270 top
R86  130R  [R0603]  7.62,8.89 270 top
R87  130R  [R0603]  10.16,8.89 270 top
R88  130R  [R0603]  12.7,8.89 270 top
R89  130R  [R0603]  15.24,8.89 270 top
R90  10k  [R0603]  19.05,75.56 90 top
R91  130R  [R0603]  40.64,8.89 270 top
R92  130R  [R0603]  43.18,8.89 270 top
R93  130R  [R0603]  45.72,8.89 270 top
R94  130R  [R0603]  27.94,8.89 270 top
R95  130R  [R0603]  30.48,8.89 270 top
R96  130R  [R0603]  33.02,8.89 270 top
R97  130R  [R0603]  35.56,8.89 270 top
R98  10k  [R0603]  32.64,30.35 0 top
R99  10k  [R0603]  36.96,27.69 90 top
R100  1M  [R0603]  29.08,33.91 90 top
R101  nc  [R0603]  39.12,27.69 270 top
R102  nc  [R0603]  26.92,33.91 270 top
R103  10k  [R0603]  48.13,14.35 0 top
R104  10k  [R0603]  48.13,12.19 0 top
R105  4.7k  [R0603]  167.64,19.05 270 top
R106  4.7k  [R0603]  167.64,22.86 90 top
R107  10k  [R0805]  201.8,108.33 0 top
R108  10k  [R0805]  201.93,101.85 0 top
R109  10k  [R0805]  205.99,101.85 180 top
R110  10k  [R0805]  205.87,108.33 180 top
R111  10k  [R0603]  209.04,38.23 270 top
R112  10k  [R0603]  207.01,38.23 270 top
R113  10k  [R0603]  201.17,40 270 top
R114  10k  [R0603]  197.36,40 270 top
R115  10k  [R0603]  194.82,40 270 top
R116  10k  [R0603]  192.15,40 270 top
R117  10k  [R0603]  189.36,40 270 top
R118  10k  [R0603]  186.44,40 270 top
R119  200R  [R0805]  89.28,29.21 0 top
R120  200R  [R0805]  69.85,96.52 90 top
R121  100R  [R0603]  60.45,44.96 90 top
S1  MOMENTARY-SWITCH-SPST-PTH-6.0MM  [TACTILE_SWITCH_PTH_6.0MM]  175.26,31.75 180 top
S2  MOMENTARY-SWITCH-SPST-PTH-6.0MM  [TACTILE_SWITCH_PTH_6.0MM]  175.26,24.13 180 top
T2  [TO92-CBE]  109.22,32.38 0 top
TVS25V  SUPRESSOR_TVS-UD-SMAJ  [SUPRESSOR_SMAJ]  48.51,101.73 180 top
U1  PIC18F47J13-I/PT  [TQFP44_10X10MC_MCH]  87.63,55.88 0 top
U2  PIC32MX564F064L-I/PT  [TQFP100_12X12MC_MCH]  157.48,76.2 0 top
U3  ESP-32S  [ESP-32S]  195.58,25.4 270 top
U4  140357145000  [WL-OCPT_SOP4]  53.34,24.13 270 top
U5  MPU-6050  [24-VFQFN]  133.48,89.79 0 top
U6  140357145000  [WL-OCPT_SOP4]  62.23,24.13 270 top
U7  140357145000  [WL-OCPT_SOP4]  71.12,24.13 270 top
U8  140357145000  [WL-OCPT_SOP4]  80.01,24.13 270 top
U9  140357145000  [WL-OCPT_SOP4]  74.93,96.27 0 top
U10  140357145000  [WL-OCPT_SOP4]  196.72,74.8 90 top
U11  140357145000  [WL-OCPT_SOP4]  113.03,113.79 270 top
U12  140357145000  [WL-OCPT_SOP4]  89.15,24.13 270 top
U$1  MP6500  [QFN65P500X500X100-25N]  127,107.95 0 top
U$2  MP6500  [QFN65P500X500X100-25N]  144.78,107.95 0 top
U$3  MP6500  [QFN65P500X500X100-25N]  162.56,107.95 0 top
X5  FPS009-3000  [FPS009-3000]  26.67,38.1 0 bottom

## Tracks (layer width: path | path; a pad name or v marks a point on that pad's centre or on a via)
3V3  (via drill 0.35)  (1 unrouted)
  Top 0.229: U2.2 158.54,80.6 | 158.54,80.6 160.21,78.93 | 158.54,80.6 158.28,80.86 U2.86 158.28,84.46 158.29,84.45 | U2.62 164.08,75.82 163.25,75.82 160.17,78.89 | U2.30 154.28,73 157.08,75.8 | U2.37 157.08,72.39 157.08,75.8 | 157.08,75.8 157.48,76.2 157.23,76.2 156.03,75 U2.16 149.08,75 C10.1 | U2.46 160.66,69.6 160.66,71.19 157.92,73.93 157.92,76.64
  Top 0.254: U2.2 149.82,80.6 C23.1 | U2.62 164.95,75.81 164.96,75.82 C22.1 | U2.46 160.68,67.3 C16.1 | U2.37 157.08,67.51 C18.1 | U2.30 154.28,67.04 C21.1 | C83.1 158.2,84.54 158.28,84.46 | U5.13 134.73,92.47 C44.1 | U5.8 136.13,89.04 137.63,87.54 C45.1
  Top 0.381: C40.1 C39.1 183.26,10.96 184.42,9.8 IC6.6 | C82.1 164.93,16.76 IC5.1 | C82.1 166.37,18.2 R105.2 | C82.1 164.68,18.63 164.19,19.13 164.19,22.31 164.39,22.51 166.44,22.51 R106.2
  Top 0.508: C29.2 98.78,74.62 R18.1 | v96.65,73.15 96.65,74.11 R18.1 | R18.1 95.09,74.62 CURRENT_SENSOR_2.1 | C49.1 19.47,57.15 R30.1 | C68.1 19.47,43.18 R29.1 | C9.2 U1.28 91.82,55.88 v91.44,56.26 | v147.7,12.57 144.59,12.57 R55.1 | v148.46,12.57 148.59,12.57 151.32,12.57 R64.1 | C5.1 39.79,57.15 R31.1 | C70.1 39.79,43.18 R28.1 | v169.29,38.23 v169.29,38.99 | v169.29,37.46 v169.29,38.99 | v170.05,37.46 v170.05,38.23 v169.29,38.99 | v170.05,38.99 v169.29,38.99 | 208.98,115.57 208.37,116.18 206.53,116.18 204.6,118.11 JP8.1 | JP9.1 204.6,111.76 206.53,109.83 208.37,109.83 208.98,109.22 | JP30.1 203.96,103.38 208.98,103.38 | JP31.1 204.47,96.52 208.98,96.52 | v195.07,14.35 195.37,14.06 R26.1 R5.1 | v192.02,22.22 192.02,26.57 197.81,32.36 200,32.36 201.31,33.67 U3.2 | v72.14,61.98 76.96,57.15 77.47,57.15 78.7,55.92 C8.2 79.25,55.08 U1.7 84.16,55.08 v84.2,55.12 | C45.1 138.46,86.88 138.46,86.36 | 138.46,86.36 138.46,81.28 138.2,81.53 138.2,81.71 135.05,84.86 130.78,84.86 | 138.46,86.36 140.72,88.62 140.72,92.33 139.7,93.34 C44.1 | R37.1 125.51,92.29 124.23,91.01 124.23,85.6 124.97,84.86 130.78,84.86 | 130.78,84.86 129.16,86.49 R36.1 | v72.9,62.74 73.03,62.61
  Top 0.635: CURRENT_SENSOR_3.1 70.81,72.99 C32.2 | 15.24,46.99 PS4.3 | 15.24,60.96 PS3.3 | R14.1 111.72,74.74 CURRENT_SENSOR_0.1 | R14.1 115.42,74.74 C20.2 | v113.16,73.28 113.79,73.91 R14.1 | v129.92,73.28 129.92,74.49 R16.1 | R16.1 128.36,74.87 CURRENT_SENSOR_1.1 | C26.2 130.37,74.8 R16.1 | 35.56,46.99 PS2.3 | R103.2 R104.2 | 33.61,31.88 33.61,30.48 R98.2 33.84,30 L3.2 | R102.1 25.78,35.9 25.76,35.9 | 33.61,31.88 R99.2 R101.1 | 33.61,31.88 33.61,32.84
  Top 0.762: 72.43,71.14 C32.2 | 72.52,71.05 72.43,71.14 | v69.85,71.12 69.87,71.14 72.43,71.14 | 16.51,57.02 C49.1 16.64,57.02 | C68.1 16.51,43.05 | MCU_1_X2.P$5 146.68,54.99 | R8.2 145.51,60.67 145.67,60.83 | IC1.28 C12.2 | C14.1 IC1.13 183.77,83.19 184.15,82.8 v184.15,78.61 178.31,78.61 174.75,82.17 163.45,82.17 160.21,78.93 160.17,78.89 157.92,76.64 157.48,76.2 | v131.32,114.55 R34.1 | v149.35,114.55 R40.1 | v167.26,114.55 R45.1 | 118.86,54.86 MCU_0_X1.P$5 120.65,56.65 120.65,66.04 | v22.61,68.96 22.61,75.18 21.38,76.41 R90.2 | 36.83,57.02 C5.1 36.96,57.02 | C70.1 36.83,43.05 | 167.64,38.1 R106.2 168.09,23.71 172.87,18.92 | R50.2 179.36,8.33 C39.1 181.37,11.58 180.23,11.58 176.67,15.14 176.66,15.14 172.87,18.92 | v200.03,37.59 201.48,37.59 | v205.61,53.72 v204.85,53.72 v204.85,52.96 v205.61,52.96 v206.38,52.96 206.38,53.34 v206.38,53.72 | 172.87,18.92 R74.2 | v170.05,37.46 170.69,36.83 R73.1 | R72.2 C66.2 97.37,8.6 96.52,7.75 JP17.1 | JP16.1 107.95,7.75 108.8,8.6 C65.2 R71.2 | R70.2 C64.2 120.23,8.47 119.38,7.62 JP15.1 | R69.2 C63.2 131.91,8.72 130.81,7.62 JP14.1 | v64.9,69.09 v65.66,69.09 v65.66,68.33 v64.9,68.33 | v22.61,68.96 v22.61,68.2 v23.37,68.96 v22.61,68.96 | MCU_2_X1.P$5 134.62,57.29 134.62,67.92 | v72.9,62.74 v72.14,61.98 | v179.2,46.99 179.41,47.2 R27.1 | 208.98,90.17 208.33,90.17 206.91,91.59 196.59,91.59 193.52,88.53 193.52,81.76 190.37,78.61 v189.48,78.61 | 138.46,72.39 139.09,73.02 v139.7,73.02 | v135.51,73.02 130.18,73.02 v129.92,73.28 | C68.1 17.91,43.18 | R103.2 48.98,31.1 47.24,32.84 33.61,32.84 30.55,35.9 25.76,35.9 24.47,37.19 24.47,39.03 22.86,40.64 19.18,40.64 C68.1
  Top 0.991: v199.26,36.83 v200.03,36.83 | v200.03,36.83 v200.03,37.59 | v200.03,37.59 v199.26,37.59 | C67.2 201.8,37.34 | 201.8,37.34 200.28,37.34 v200.03,37.59 | U3.2 201.31,36.31 | v200.03,36.83 200.79,36.83 201.31,36.31 | 201.31,36.31 201.31,36.84 201.8,37.34
  Top 1.016: 140.97,67.92 138.46,70.43 138.46,72.39 138.46,81.28
  Top 1.27: C32.2 72.79,71.74 72.79,72.2 73.79,73.2 R20.1 | MCU_0_X1.P$5 117.94,54.9 117.35,55.5 117.35,60.64 R10.2 | MCU_2_X1.P$5 132.04,55.41 131.25,56.2 R12.2 | R8.2 145.35,55.56 145.88,55.03 MCU_1_X2.P$5 147.32,55.64 147.32,67.31 146.71,67.92 140.97,67.92 134.62,67.92 122.91,67.92 121.03,66.04 120.65,66.04 82.93,66.04 79.5,62.61 73.03,62.61 | v205.61,53.72 205.61,55.75 JP1.1 | v204.85,52.96 203.33,51.44 JP26.3 | v206.38,52.96 208.98,55.56 208.98,90.17 208.98,96.52 208.98,103.38 208.98,109.22 208.98,115.57 | 92.71,38.1 93.34,37.46 93.56,37.46 95.25,35.78 95.25,15.24 97.79,12.7 | 131.19,12.7 139.7,12.7 142.24,15.24 145.92,15.24 148.59,12.57 | 131.19,12.7 119.51,12.7 | 119.51,12.7 108.27,12.7 | 108.27,12.7 97.79,12.7 | v148.46,12.57 v147.7,12.57 | R72.2 97.79,11.88 97.79,12.7 | R71.2 108.27,12.7 | R70.2 122.05,10.16 119.51,12.7 | R69.2 131.19,12.64 131.19,12.7
  Top 1.905: v22.61,68.2 36.02,68.2 37.38,66.84 63.41,66.84 v64.9,68.33 | v179.2,46.99 185.55,53.34 206.38,53.34
  Top 2.032: PS3.3 16.64,59.13 C49.1 | PS4.3 16.64,45.16 C68.1 | PS5.3 36.96,59.13 C5.1 | PS2.3 36.96,45.16 C70.1
  Top 2.54: C70.1 36.96,39.24 38.1,38.1 92.71,38.1 167.64,38.1 169.93,38.1 | 169.93,38.1 v170.05,38.23 | PS5.3 35.08,61.01 35.08,61.38 31.92,64.54 18.62,64.54 17.79,63.71 17.79,63.51 15.24,60.96 | 169.93,38.1 170.18,38.1 179.07,46.99 v179.2,46.99
  Bottom 0.508: 156.64,122.22 149.35,114.94 v149.35,114.55 | 156.64,122.22 139.37,122.22 131.7,114.55 v131.32,114.55 | v167.26,114.55 167.26,115.47 168.45,116.67 168.45,121.51 169.16,122.22 | IC1.28 189.61,113.66 181.05,122.22 169.16,122.22 | 169.16,122.22 156.64,122.22 | v192.02,22.22 192.53,21.72 194.69,21.72 197.36,19.05 197.36,16.64 v195.07,14.35 | v84.2,55.12 90.3,55.12 v91.44,56.26 | v177.93,46.99 178.44,46.48 v178.56,46.48 | v23.37,68.96 v23.37,68.2 | 72.75,62.13 72.9,62.28 v72.9,62.74
  Bottom 0.762: v69.85,71.12 67.82,69.09 v65.66,69.09 | IC1.28 190.47,113.31 190.95,113.31 194.79,109.47 194.79,103.98 195.55,103.23 198.15,103.23 200.33,105.41 JP30.1 | v189.48,78.61 v184.15,78.61 | v135.51,73.02 v139.7,73.02 | v129.92,73.28 v113.16,73.28
  Bottom 1.27: v22.61,68.2 22.61,67.9 PS3.3 PS4.3 | PS2.3 PS5.3 | 180.09,43.31 180.09,44.83 v177.93,46.99 177.93,46.86 v177.42,46.35 177.55,46.35 v178.05,45.85 v179.2,46.99 179.07,46.99 v178.56,47.5
  Bottom 1.524: v199.26,37.59 197.58,37.59 194.48,40.69 181.56,40.69 180.09,42.16 180.09,43.31 | v64.9,69.09 70.48,63.5 71.37,63.5 72.75,62.13 72.9,62.13
5V  (via drill 0.35)
  Top 0.508: C84.1 60.11,57.15 R61.1 | C86.1 60.11,44.45 R121.1 | JP23.3 204.34,11.43 202.41,9.5 201.56,9.5 200.56,8.5 200.56,5.1 199.87,4.42 194.97,4.42 185.42,13.97 181.74,13.97 179.32,16.38 179.32,19.3 v178.82,19.81 | v176.53,21.08 172.57,25.04 171.45,25.04 168.91,27.59 v168.91,36.07
  Top 0.762: v101.09,41.4 101.09,41.17 100.2,40.28 | v101.85,41.4 101.85,41.22 100.92,40.28 | v101.98,36.19 v101.22,36.19 99.21,34.19 99.21,25.55 LS2.+ | v166.24,41.53 v166.24,42.29 | v166.24,42.29 v165.48,42.29 v165.48,41.53 | v166.24,42.29 v167,42.29 v167,41.53 | U10.4 198.48,74.93 JP5.2
  Top 1.27: v38.48,70.61 37.34,70.61 38.1,69.85 v38.48,69.85 v38.48,70.61 | v38.48,70.61 v39.24,69.85 | v38.48,70.61 v39.24,70.61 | C86.1 61.45,40.28 100.2,40.28 100.92,40.28 165.23,40.28 | 165.23,40.28 169.34,40.28 184.93,55.88 JP22.1 200.15,55.88 202.06,57.78 202.06,73.53 203.45,74.93 JP5.2 | 165.23,40.28 166.24,41.3 v166.24,41.53
  Top 2.032: PS6.3 57.28,59.13 C84.1 | PS7.3 57.28,46.43 C86.1
  Bottom 0.508: v168.91,36.07 166.24,38.74 v166.24,41.53 | v178.82,19.81 178.11,20.52 177.95,20.52 177.4,21.08 v176.53,21.08
  Bottom 1.27: v39.24,69.85 46.56,69.85 PS6.3 PS7.3
  Bottom 1.524: v101.09,41.4 v101.85,41.4 101.85,36.83 v101.22,36.19
12V_STEPPER_0_POS  (via drill 0.35)
  Top 0.305: U$1.10 127.32,104.32
  Top 0.381: 127.32,104.32 v127.38,104.27 | U$1.22 126.62,110.46 v126.62,111.51
  Top 0.508: C41.1 v126.62,112.27
  Top 0.762: v133.73,104.52 133.44,104.81 C36.1 | C43.1 126.2,102.87 127.38,102.87 127.51,102.74 C42.1 | v127.38,104.27 v127.38,103.5
  Top 1.27: CURRENT_SENSOR_0.7 106.53,82.55 108.33,82.55 127.38,101.6 127.38,102.87 v127.38,103.5
  Bottom 0.762: v127.38,104.27 127.28,104.37 127.28,104.64 126.62,105.3 v126.62,111.51 v126.62,112.27 | v133.73,104.52 v132.97,104.52 131.7,103.25 127.63,103.25 v127.38,103.5
12V_STEPPER_1_POS  (via drill 0.35)
  Top 0.432: U$2.10 145.1,104.2 v145.16,104.14 | U$2.22 144.46,111.45 v144.4,111.51
  Top 0.635: C56.1 144.65,102.87 v145.16,103.38 145.67,102.87 C54.1
  Top 0.762: v144.4,111.51 v144.4,112.27 C55.1 | v151.51,104.52 151.22,104.81 C53.1 | v145.16,104.14 v145.16,103.38
  Top 1.27: CURRENT_SENSOR_1.7 120.96,92.28 126.98,98.3 141.86,98.3 145.16,101.6 v145.16,103.38
  Bottom 0.762: v145.16,103.38 149.61,103.38 v150.75,104.52 v151.51,104.52 | v145.16,104.14 145.06,104.24 145.06,104.77 144.4,105.43 v144.4,111.51
!CP_SUSPEND
  Top 0.305: R49.2 182.52,5.9 182.52,6.13 182.74,6.35 IC6.11
BATT_ADC  (via drill 0.35)
  Top 0.483: U1.21 90.85,50.24 90.85,49.45 91.31,49 v91.31,48.51 | v91.06,42.16 91.06,42.07 90.55,41.57
  Top 0.508: 55.12,71.25 R7.2 54.17,70.23 v53.47,70.23
  Top 0.635: 90.55,41.57 65.24,41.57 62.99,43.81 62.99,49.53 v63.75,50.29
  Top 0.762: R6.1 55.12,71.25
  Bottom 0.762: v53.47,70.23 63.75,59.94 v63.75,50.29 | v91.31,48.51 91.31,42.42 v91.06,42.16
BATT_DIRECT_POS_POLE
  pour Top (no thermals): 39.37,121.92 39.37,110.49 48.26,110.49 52.07,114.3 54.61,114.3 56.9,116.59 56.9,121.92
BATT_POS  (via drill 0.35)
  Top 0.432: U$3.10 162.89,104.2 v162.94,104.14 | U$3.22 162.24,111.7 v162.18,111.76
  Top 0.762: v162.18,111.76 v162.18,112.52 C60.1 | v162.94,103.38 162.89,103.43 162.89,104.2 | C62.1 162.56,103 v162.94,103.38 | C61.1 163.32,103 v162.94,103.38 | v169.29,104.39 169,104.69 C59.1 169,104.86 v168.53,104.39
  Top 1.27: 120.78,69.34 134.11,69.34 137.16,72.39 137.16,81.28 134.62,83.82 124.46,83.82 123.19,85.09 123.19,91.44 128.25,96.5 142.57,96.5 146.41,100.33 161.29,100.33 162.94,101.98 v162.94,103.38 | U4.4 57.15,23.52 | 57.15,23.52 57.15,34.77 | U6.4 66.04,23.52 | U7.4 74.93,23.52 | 74.93,23.52 74.93,34.77 | U8.4 83.82,23.52 | 83.82,23.52 83.82,34.77 | 93.22,23.77 93.22,6.06 91.07,3.91 88.67,3.91 87.63,4.95 JP25.1 | 83.82,23.52 83.82,5.68 81.92,3.78 80.51,3.78 78.74,5.56 JP13.1 | 74.93,23.52 74.93,5.68 73.03,3.78 71.75,3.78 69.85,5.68 JP12.1 | 66.04,23.52 66.04,5.68 64.27,3.91 62.73,3.91 60.96,5.68 JP11.1 | JP10.1 52.07,5.84 54,3.91 55.38,3.91 57.15,5.68 57.15,23.52 | 93.22,23.77 93.22,34.14 92.58,34.77 | U12.4 93.22,23.77 | 66.04,23.52 66.04,34.26 65.53,34.77
  Top 1.905: 29.08,59.13 PS5.1 | C50.1 8.76,55.12 10.67,53.21 10.16,52.7 PS4.1 | 29.21,57.02 C48.1 29.08,55.63 31.5,53.21 33.02,53.21 30.48,50.67 PS2.1 | PS7.1 50.8,50.67 53.34,53.21 51.56,53.21 49.4,55.38 C87.1 49.53,57.02
  Top 2.032: C48.1 29.08,59.13 | PS2.1 29.08,45.16 C71.1 | PS3.1 8.76,59.13 C50.1 | PS4.1 8.76,45.16 C69.1 | PS6.1 49.4,59.13 C87.1 | PS7.1 49.4,46.43 C85.1
  Top 2.54: 81.29,73.66 82.55,73.66 | 81.28,72.77 81.28,74.93 | 24.13,53.21 25.4,51.94 25.4,41.91 26.12,41.19 27.95,41.19 28.85,40.28 | 28.85,40.28 34.36,34.77 57.15,34.77 65.53,34.77 74.93,34.77 83.82,34.77 92.58,34.77 | C71.1 29.08,40.51 28.85,40.28
  Top 3.81: 82.55,74.93 82.55,71.12 | 10.67,53.21 24.13,53.21 33.02,53.21 53.34,53.21 64.64,53.21 66.29,54.86 66.29,62.87 68.83,65.4 78.23,65.4 83.69,70.87 83.69,71.12
  Top 5.08: 69.98,86.49 79.88,86.49 82.55,83.82 82.55,74.93
  Bottom 0.762: v162.94,103.38 167.51,103.38 v168.53,104.39 | v162.94,104.14 162.58,104.5 162.58,104.77 162.18,105.18 v162.18,111.76
  pour Top (no thermals): 64.52,76.83 62.99,76.83 61.09,78.74 61.09,85.47 64.39,88.77 70.1,88.77 70.23,88.65 70.23,84.07 66.17,80.01 66.17,79.12 64.9,79.12 64.52,78.74
  pour Top (no thermals): 90.17,77.98 89.41,77.98 89.41,76.2 88.9,75.69 88.77,75.69 81.53,75.69 80.39,74.55 80.39,71.37 88.77,71.37 90.17,72.77
  pour Top (isolate 0.406, no thermals): 80.26,72.39 100.33,72.39 103.63,75.69 105.66,75.69 106.04,76.07 106.04,78.1 106.81,78.1 106.93,77.98 106.93,72.39 116.59,72.39 120.01,75.82 122.17,75.82 122.56,76.2 122.56,78.1 123.32,78.1 123.32,69.98 120.52,67.18 80.26,67.18
BATT_POS_POLE
  Top 3.81: Q8.3 59.69,102.87
  pour Top (no thermals): 56.9,110.74 55.88,111.76 53.34,111.76 52.07,110.49 52.07,105.41 54.61,102.87 54.61,100.33 62.23,100.33 62.23,106.17 56.9,106.17
BATT_POS_POLE_SWITCH
  pour Top (no thermals): 57.4,121.92 57.4,106.68 62.23,106.68 62.23,121.92
BLADE_MOTOR_NEG_EXT
  Top 0.508: 105.41,101.85 D9.A
  Top 1.27: 105.41,101.85 105.41,102.97 BSC027N04LSG1.8 BSC027N04LSG1.7 BSC027N04LSG1.6 BSC027N04LSG1.5 103.73,110.08 D11.C
  pour Top (no thermals): 98.3,120.9 98.3,117.73 102.36,113.66 102.36,100.96 103.5,99.82 107.44,99.82 108.33,100.71 108.33,102.49 107.82,103 107.82,110.36 108.33,110.87 108.33,113.41 105.92,115.82 104.14,117.6 104.14,120.65 103.63,121.16 99.06,121.16 98.55,121.16
BLADE_MOTOR_POS
  Top 0.635: D10.A 93.98,91.44 101.6,83.82 107.73,83.82 117.37,93.45 117.37,107.58 U11.4
  pour Top (isolate 0.254, no thermals): 90.17,81.66 90.17,78.99 88.9,78.99 88.52,78.61 88.52,76.71 87,76.71 87,81.66
  pour Top (no thermals): 90.17,78.99 92.71,81.53 92.71,92.71 87.25,92.71 87.12,92.71 87.12,79.12 90.04,79.12
BLADE_MOTOR_POS_EXT
  pour Top (no thermals): 97.41,117.73 97.41,120.9 97.16,121.16 93.22,121.16 92.71,120.65 92.71,115.57 92.71,114.3 93.98,113.03 93.98,110.49 93.98,110.24 86.87,103.12 86.87,99.82 87.63,99.06 88.9,97.79 92.71,97.79 95.25,97.79 103.38,89.66 107.44,89.66 107.57,89.66 108.71,90.81 108.71,92.07 107.7,93.09 101.6,99.19 101.6,113.03 97.41,117.22
CP2102_RXD  (via drill 0.35)
  Top 0.279: IC6.25 191.01,6.35 v191.26,6.6
  Top 0.381: v198.75,14.6 198.75,16.13 U3.35
  Bottom 0.508: v198.75,14.6 198.75,14.1 v191.26,6.6
CP2102_TXD  (via drill 0.35)
  Top 0.279: IC6.26 188.59,6.85 188.59,6.86 190.03,6.86 190.5,7.33
  Top 0.33: 190.5,7.33 v190.5,7.49
  Top 0.381: v197.49,14.6 197.49,16.13 U3.34
  Bottom 0.508: v190.5,7.49 197.49,14.48 v197.49,14.6
CP_RST
  Top 0.305: IC6.9 181.94,7.35 R50.1
CURRENT_SENSOR_3_POS
  Top 0.762: R6.2 49.53,71.57 49.53,74.93 | 43.18,76.2 44.45,74.93 | 55.88,77.47 58.42,74.93
  Top 1.27: R6.2 49.85,73.34
  Top 2.54: C72.+ 55.88,77.47 | C3.+ 43.18,76.2 | C2.+ 49.53,74.93
  Top 5.08: L1.1 30.98,84.59 40.64,74.93 44.45,74.93 49.53,74.93 58.42,74.93
  pour Top (no thermals): 58.29,77.22 61.09,77.22 62.48,75.82 64.9,75.82 65.41,76.33 65.41,78.1 66.17,78.1 66.17,73.15 64.01,70.99 59.82,70.99 58.29,72.64
D_N  (via drill 0.35)
  Top 0.305: IC6.5 184.92,9.53 v185.17,9.78
  Top 0.381: D5.C v174.88,12.95
  Top 0.457: J3.2 170.33,6.64 170.33,8 170.34,8 170.34,8.45 170.35,8.47 170.35,8.79 171.31,9.75 173.99,9.75 174.88,10.64 D5.C
  Bottom 0.381: v174.88,12.95 176.4,11.43 183.52,11.43 v185.17,9.78
D_P  (via drill 0.35)
  Top 0.305: IC6.4 185.42,9.02 185.47,9.06 185.47,9.08 185.64,9.25 185.66,9.25 v186.18,9.78
  Top 0.381: D4.C v176.15,12.95
  Top 0.457: J3.3 170.96,6.62 170.96,8.53 171.57,9.14 174.62,9.14 176.15,10.67 D4.C
  Bottom 0.381: v176.15,12.95 183.01,12.95 185.59,10.37 186.01,9.95 v186.18,9.78
EXTERNAL_GND  (via drill 0.35)
  other vias: 83.82,104.14 85.09,104.14 85.09,101.6 83.82,101.6 85.09,100.33 83.82,100.33 83.82,102.87 85.09,102.87
  pour Top (isolate 0.61, no thermals): 69.85,119.38 85.09,119.38 85.09,97.79 81.28,93.98 77.47,93.98 77.47,99.06 76.2,100.33 69.85,100.33
  pour Bottom (isolate 0.61, rank 4, no thermals): 69.85,118.75 69.85,99.06 76.2,99.06 76.2,93.98 81.28,93.98 85.09,97.79 85.09,118.75
EXTERNAL_INPUT_ADC  (via drill 0.35)
  Top 0.381: v81.66,89.03 81.14,89.55 73.26,89.55 68.83,93.98 v68.33,93.98
  Top 0.508: R78.1 73.66,109.22 | 73.66,109.22 R79.2 | 73.66,109.22 v73.66,107.7 | U1.22 91.63,49.72 92.2,49.15 v92.33,49.15
  Top 0.635: v86.49,57.78 91.31,52.96 v91.31,52.58
  Bottom 0.381: 69.06,94.31 68.74,93.98 v68.33,93.98
  Bottom 0.508: v73.66,107.7 73.66,98.9 69.06,94.31 | v86.49,57.78 86.34,57.78 81.89,62.23 81.89,88.8 v81.66,89.03 | v91.31,52.58 92.33,51.56 v92.33,49.15
EXTERNAL_POS
  Top 0.254: R78.2 78.74,109.22
  Top 1.27: 78.74,109.22 80.01,107.95 R77.1 78.81,105.15 Q8.2
  Top 5.08: J2.2 81.07,109.03 Q8.2
GND  (via drill 0.35)
  Top 0.229: U2.45 160.28,68.32 159.51,67.55 159.51,66.23 160.27,65.46 C16.2 | U2.36 156.68,68.53 155.7,67.55 155.7,66.23 156.46,65.46 C18.2 | U2.31 154.68,68.07 155.2,67.55 155.2,65.96 C21.2 | U2.15 152.36,75.4 153.29,76.33 v153.54,76.33 | U2.75 164.08,80.98 163.25,80.98 162.31,80.04 v162.31,78.74 163.09,77.95 163.09,77.18 163.27,77 U2.65 | v162.56,75.56 163.09,75.03 163.09,73.18 163.27,73 U2.55 167.03,73 v167.13,72.9
  Top 0.254: U5.18 132.23,93.02 C46.1 | U5.11 136.26,90.54 137.79,92.07 C47.2 | U5.9 137.5,89.53 C45.2
  Top 0.279: IC6.1 187.12,8.45 187.12,8.13 | 187.29,7.39 187.34,7.35 IC6.27
  Top 0.305: 143.89,109.09 143.16,109.83 U$2.24 142.05,111.51 | U$2.8 143.81,107.34 | U$3.8 161.59,106.97 | 162,107.62 U$3.4 158.81,107.62 | IC6.3 IC6.2 | IC6.2 IC6.1 | 187.29,7.39 187.12,7.57 187.12,8.13 187.29,8.3 187.38,8.3 IC6.M | IC6.23 186.42,5.35 IC6.EXP 186.42,7.35 IC6.2 | U$1.8 126.03,106.72 | 127.25,107.62 128.62,106.25 U$1.12 129.58,105.5 v130.18,104.9 | U$1.20 127.97,109.43 127.89,109.35 | v124.71,111.25 125.38,110.59 U$1.24 125.38,109.7 125.73,109.35 126.05,109.35 | 144.09,107.62 U$2.4 141.15,107.62 141.1,107.57
  Top 0.381: 126.05,109.35 127.89,109.35 | 125.8,107.62 U$1.4 123.63,107.62 v123.44,107.44 | 127.32,107.62 127.25,107.62 125.8,107.62 | 126.03,107.4 125.8,107.62 | 124.71,111.06 v124.71,111.25 | 143.89,109.09 145.54,109.09 145.67,109.22 | U$2.20 145.75,109.31 | U$2.25 144.91,107.95 146.41,106.45 U$2.12 146.75,105.16 147.83,105.16 v148.21,104.77 | 143.81,107.34 144.09,107.62 | 141.1,107.57 v140.97,107.44 | 142.05,111.51 v141.99,111.51 | U$3.25 162.56,108.2 160.94,109.83 U$3.24 159.89,111.44 159.89,111.63 | U$3.20 163.53,108.93 U$3.25 | 161.59,106.97 162.12,107.5 | 162.12,107.5 U$3.25 | U$3.25 164.19,106.32 U$3.12 164.57,105.12 165.02,105.12 165.49,104.65 v166.12,104.65 | 162,107.62 162.12,107.5 | 158.81,107.62 v158.75,107.57 | C40.2 185.59,12.66 186.92,11.33 IC6.1 187.33,8.65 IC6.M | R49.1 179.53,4.44 180.57,3.41 187.21,3.41 188.36,4.56 188.36,5.14 188.16,5.34 186.43,5.34 IC6.EXP | v91.82,57.78 91.78,57.75 91.78,57.46 92.57,56.68 U1.29 | v83.69,56.39 83.19,55.88 U1.6 | U9.2 71.91,94.87 71.91,93.37
  Top 0.508: 71.91,93.37 v71.88,93.34 | CURRENT_SENSOR_2.2 94.34,75.84 | 125.8,107.62 125.86,107.57 | 126.03,106.72 126.11,106.81 | 144.09,107.62 144.15,107.57 | 143.81,106.72 143.89,106.81 | 145.67,109.22 145.75,109.31 | 161.59,106.59 161.67,106.68 | 161.36,107.62 161.42,107.57 | CURRENT_SENSOR_1.2 125.96,75.97 125.73,76.2 | CURRENT_SENSOR_0.2 110.21,75.97 | 68.86,69.57 68.1,69.57 v67.31,70.36 | 68.35,75.97 67.31,74.93 v67.31,71.12 | J3.4 171.59,8.27 171.83,8.51 173.47,8.51 J3.S4 | 172.24,7.21 J3.5 | U1.29 95.73,56.68 95.84,56.79 97.35,56.79 C9.1 | U1.6 v79.88,55.88 | C40.2 C39.2 | D4.A D5.A D3.A 172.36,14.2 C38.1 C37.1 | U11.2 111.66,116.84 109.22,116.84 | C32.1 76.07,73.32 C33.2 | IC5.7 161.25,21.12 161.16,21.21
  Top 0.635: C31.2 74.47,80.81 74.98,80.81 | 77.04,75.42 76.77,75.14 76.75,75.14 C33.2 | R23.2 113.85,107.12 v113.66,106.93 | R35.2 120.69,107.62 R3.1 121.2,107.44 v122.56,107.44 | 94.34,75.84 93.37,75.84 92.96,75.44 | C7.2 101.01,53.25 101.01,53.31 101.07,53.37 101.07,54.61 99.8,55.88 v99.57,55.88 C9.1 | C8.1 v75.82,55.63 | J3.S4 177.53,4.44 R49.1
  Top 0.762: 74.93,69.85 73.17,69.85 72.9,69.57 68.86,69.57 | CURRENT_SENSOR_3.2 68.35,75.97 | v122.56,107.44 v123.44,107.44 | v124.71,111.25 124.33,111.63 v124.33,111.89 | v140.97,107.44 v140.21,107.44 138.85,107.44 R2.1 | v141.48,112.14 142.05,111.57 142.05,111.51 | v159.39,112.14 159.89,111.63 v159.89,111.51 | v158.75,107.57 v157.99,107.57 157.69,107.28 R42.1 | 162.18,116.2 v161.8,116.59 v162.56,116.59 162.18,116.2 | C60.2 162.18,116.2 | 144.4,115.95 v144.78,116.33 v144.02,116.33 144.4,115.95 | C55.2 144.4,115.95 | U12.2 86.64,27.28 86.61,27.31 | U8.2 77.37,27.28 77.34,27.31 | U7.2 68.35,27.28 68.33,27.31 | U6.2 59.46,27.28 59.44,27.31 | U4.2 50.57,27.28 50.55,27.31 | R109.1 206.94,99.13 JP31.3 | R110.1 206.82,105.6 JP30.3 | U3.15 185.91,31.1 v185.93,31.11 | v126.24,116.46 126.33,116.46 126.62,116.17 C41.2 126.62,116.08 v127,116.46 v126.24,116.46
  Top 1.27: C50.2 12.7,58.29 | C49.2 12.7,58.29 | 12.7,58.29 PS3.2 | C69.2 12.7,44.32 | C68.2 12.7,44.32 | 12.7,44.32 PS4.2 | C48.2 33.02,58.29 | C71.2 33.02,44.32 | C70.2 33.02,44.32 | 33.02,44.32 PS2.2 | C5.2 33.02,58.29 | 33.02,58.29 PS5.2 | v108.84,72.14 108.84,74.29 109.6,73.53 v109.6,72.14 | PS7.2 53.34,45.59 | 53.34,45.59 C85.2 | 53.34,45.59 C86.2 | PS6.2 53.34,58.29 | 53.34,58.29 C87.2 | 53.34,58.29 C84.2 | U10.2 198.02,71.63 199.77,71.63
  Bottom 0.635: v75.82,55.63 76.07,55.88 v79.88,55.88
  Bottom 0.762: v45.85,13.59 44.45,13.59 44.32,13.46 43.51,13.46 X5.COM_TERM
  Bottom 1.27: v71.88,93.34 83.89,93.34 85.39,94.85 93.58,94.85 109.22,110.49
  other vias: 66.55,71.12 66.55,70.36 125.48,78.49 125.48,79.25 134.37,80.77 118.11,80.77 102.23,76.58 110.62,106.93 111.38,106.93 112.9,106.93 110.62,106.17 111.38,106.17 112.14,106.17 112.9,106.17 110.62,105.41 111.38,105.41 112.14,105.41 112.9,105.41 110.62,104.65 111.38,104.65 112.9,104.65 112.14,104.65 112.14,106.93 110.62,103.89 111.38,103.89 112.14,103.89 112.9,103.89 113.66,103.89 113.66,104.65 113.66,105.41 113.66,106.17 202.95,40.13 202.95,39.37 199.26,40.77 191.14,37.85 201.93,111.25 201.93,110.49 179.07,14.1 185.55,37.85 187.2,27.31 132.97,94.87 125.48,89.53 139.57,90.3 135.51,74.8 160.02,81.03 148.34,69.6 109.22,78.74 109.22,77.98 91.82,18.92 82.55,19.05 73.66,19.05 64.77,19.05 55.88,19.05 153.67,54.61 99.57,56.64 91.82,19.69 91.82,18.16 82.55,19.81 82.55,18.29 73.66,19.81 73.66,18.29 64.77,19.81 64.77,18.29 55.88,19.81 55.88,18.29 177.93,42.16 178.44,41.53 178.94,40.89 185.93,106.04 186.44,105.41 187.07,104.9 30.48,34.04 74.93,45.72 75.69,45.72 74.93,44.96 75.69,44.96 172.47,79.12 173.23,79.12 139.95,102.87 140.72,102.87 197.1,93.6 197.87,93.6 66.42,45.08 66.42,44.32 66.42,43.56 67.18,45.08 67.18,44.32 67.18,43.56 74.17,44.96 74.17,45.72 74.17,46.48 74.93,46.48 75.69,46.48 82.17,47.24 82.93,47.24 83.69,47.24 83.69,46.48 82.93,46.48 82.17,46.48 90.17,57.4 106.3,58.67 106.3,57.91 107.06,58.67 107.06,57.91 123.57,60.58 123.57,59.82 124.33,60.58 124.33,59.82 128.14,32.64 128.91,32.64 128.14,31.88 128.91,31.88 173.99,120.65 152.4,120.65 187.96,121.92 133.35,119.38 119.38,120.65 17.78,87.63 18.54,87.63 19.3,87.63 20.07,87.63 20.07,86.87 19.3,86.87 18.54,86.87 17.78,86.87 17.78,86.11 18.54,86.11 19.3,86.11 20.07,86.11 34.8,38.1 23.24,33.27 18.92,32.64 17.4,31.62 15.75,30.86 11.3,28.96 6.35,24.89 5.21,23.62 179.96,62.99 187.96,121.16 160.4,75.82 158.5,62.61 161.67,85.34 150.5,83.82 44.58,27.43 50.8,31.24 46.99,41.4 46.23,41.4 92.07,75.69 96.77,83.82 114.55,84.33 189.36,37.97 137.16,62.23 137.16,61.47 137.92,62.23 138.68,62.23 138.68,61.47 137.92,61.47 159.13,17.4 159.89,17.4 159.13,16.64 159.89,16.64
  pour Top (no thermals): 108.84,107.57 108.84,103.25 114.55,103.25 114.55,107.57
  pour Top (isolate 0.305, rank 6, no thermals): -1.27,128.27 -1.27,-1.27 213.36,-1.27 213.36,128.27
  pour Bottom (isolate 0.61, rank 6, no thermals): 0,127 0,0 212.09,0 212.09,127
  pour Route2: -1.27,128.27 -1.27,-1.27 213.36,-1.27 213.36,128.27
  pour Route15: -2.54,129.54 -2.54,-2.54 214.63,-2.54 214.63,129.54
GPS_RXD  (via drill 0.35)
  Top 0.229: U2.48 161.48,68.23 162.15,67.56 162.31,67.56 v163.19,66.68
  Bottom 0.762: v163.19,66.68 164.74,65.13 164.74,64.79 164.82,64.72 170.17,64.72 174.64,60.25 190.98,60.25 196.44,65.71 199.8,65.71 202.01,63.5 JP1.4
GPS_TXD  (via drill 0.35)
  Top 0.229: U2.47 161.08,67.39 162.24,66.23 v162.18,66.17
  Bottom 0.762: v162.18,66.17 163.83,64.52 163.83,64.41 164.44,63.8 169.79,63.8 174.26,59.33 191.36,59.33 196.82,64.79 199.42,64.79 203.25,60.96 JP1.3
LIDAR_RX
  Bottom 0.508: JP5.4 201.93,76.2 190.5,76.2 186.69,72.39 JP21.2
LIDAR_TX
  Bottom 0.508: JP5.7 194.97,76.86 190.23,76.86 185.52,72.16 185.52,68.6 186.69,67.44 JP20.2
LIMIT_SWITCH_BOTTOM_MAGNET
  Top 0.508: R108.1 200.47,101.35 JP35.1
LIMIT_SWITCH_BOTTOM_MECHANICAL
  Top 0.508: 198.12,112.08 R60.1 198.63,110.24 198.78,110.08 198.78,109.12 197.89,108.23 195.6,108.23 192.03,104.66 189.64,104.66 188.96,103.98 188.96,100.49 189.64,99.81 193.31,99.81 JP35.3
LIMIT_SWITCH_UPPER_MAGNET
  Top 0.508: R107.1 197.04,104.52 JP34.1
LIMIT_SWITCH_UPPER_MECHANICAL
  Top 0.508: R59.1 198.41,115.04 197.71,115.04 197.46,114.79 197.46,110.21 JP34.3
MCU_0_BUZZER  (via drill 0.35)
  Top 0.483: U1.35 90.83,62.64 v91.95,63.75
  Top 0.635: v100.33,32.38 R24.1 | v101.85,52.96 101.85,61.98 100.84,62.99 v97.54,62.99 | v96.65,46.86 96.77,46.99 v99.31,46.99
  Bottom 0.635: v101.85,52.96 101.85,52.32 100.33,50.8 100.33,48.01 v99.31,46.99 | v97.54,62.99 96.77,63.75 v91.95,63.75 | v96.65,46.86 96.65,40.77 97.37,40.05 97.37,35.35 v100.33,32.38
MCU_0_CHARGING_INPUT_ENABLE  (via drill 0.35)
  Top 0.381: v82.68,88.26 82.38,88.56 82.38,89.33 81.62,90.08 73.62,90.08 69.85,93.85 | R85.1 6.6,28.54 v6.6,35.69
  Top 0.508: U1.41 86.03,62.47 85.96,62.54 85.96,63.19 85.98,63.21 v85.98,63.5 | R120.1 v69.85,93.98 69.85,93.85
  Bottom 0.381: v69.85,93.98 69.59,93.98 67.38,91.77 8.61,91.77 5.74,88.9 5.74,44.58 8.38,41.94 14.84,41.94 17.87,38.91 17.87,37.04 16.17,35.35 6.94,35.35 v6.6,35.69
  Bottom 0.508: v85.98,63.5 85.09,63.5 82.55,66.04 82.55,88.14 v82.68,88.26
MCU_0_CURRENT_SENSOR_0  (via drill 0.35)
  Top 0.381: v110.24,78.99 110.24,80.77 v110.11,80.9
  Top 0.483: U1.19 89.23,48.31 v89.41,48.13
  Top 0.635: R15.2 v117.35,78.74
  Bottom 0.381: v117.35,78.74 110.49,78.74 v110.24,78.99 | v110.11,80.9 109.82,80.61 100.08,80.61 91.1,71.62 91.1,57.49 91.6,56.98 91.74,56.98 92.16,56.56 92.16,55.96 89.32,53.12 89.32,48.6 89.41,48.51 v89.41,48.13
MCU_0_CURRENT_SENSOR_1  (via drill 0.35)
  Top 0.483: U1.20 90.04,50.25 v90.04,48.89
  Top 0.635: R17.2 v133.86,78.87
  Bottom 0.508: v90.04,48.89 90.53,49.38 90.53,52.9 94.08,56.46 94.08,59.38 96.91,62.21 97.86,62.21 98.32,62.67 98.32,78 100.33,80.01 117.76,80.01 117.78,79.99 118.44,79.99 118.97,80.52 125.98,80.52 127.63,78.87 v133.86,78.87
MCU_0_CURRENT_SENSOR_2  (via drill 0.35)
  Top 0.483: U1.25 94.91,53.48 94.93,53.46 96.15,53.46 v96.39,53.21
  Top 0.508: R19.2 v100.33,78.61
  Bottom 0.508: v100.33,78.61 99.06,77.34 99.06,62.47 98.13,61.55 97.19,61.55 96.42,60.78 96.42,53.9 96.39,53.88 v96.39,53.21
MCU_0_CURRENT_SENSOR_3  (via drill 0.35)
  Top 0.483: v95.63,54.23 94.94,54.23 94.94,54.22 94.29,54.22 94.23,54.28 U1.26 91.52,54.28 v87.76,58.04